# EAGLE schematic Full (EAGLE 9.6.2)
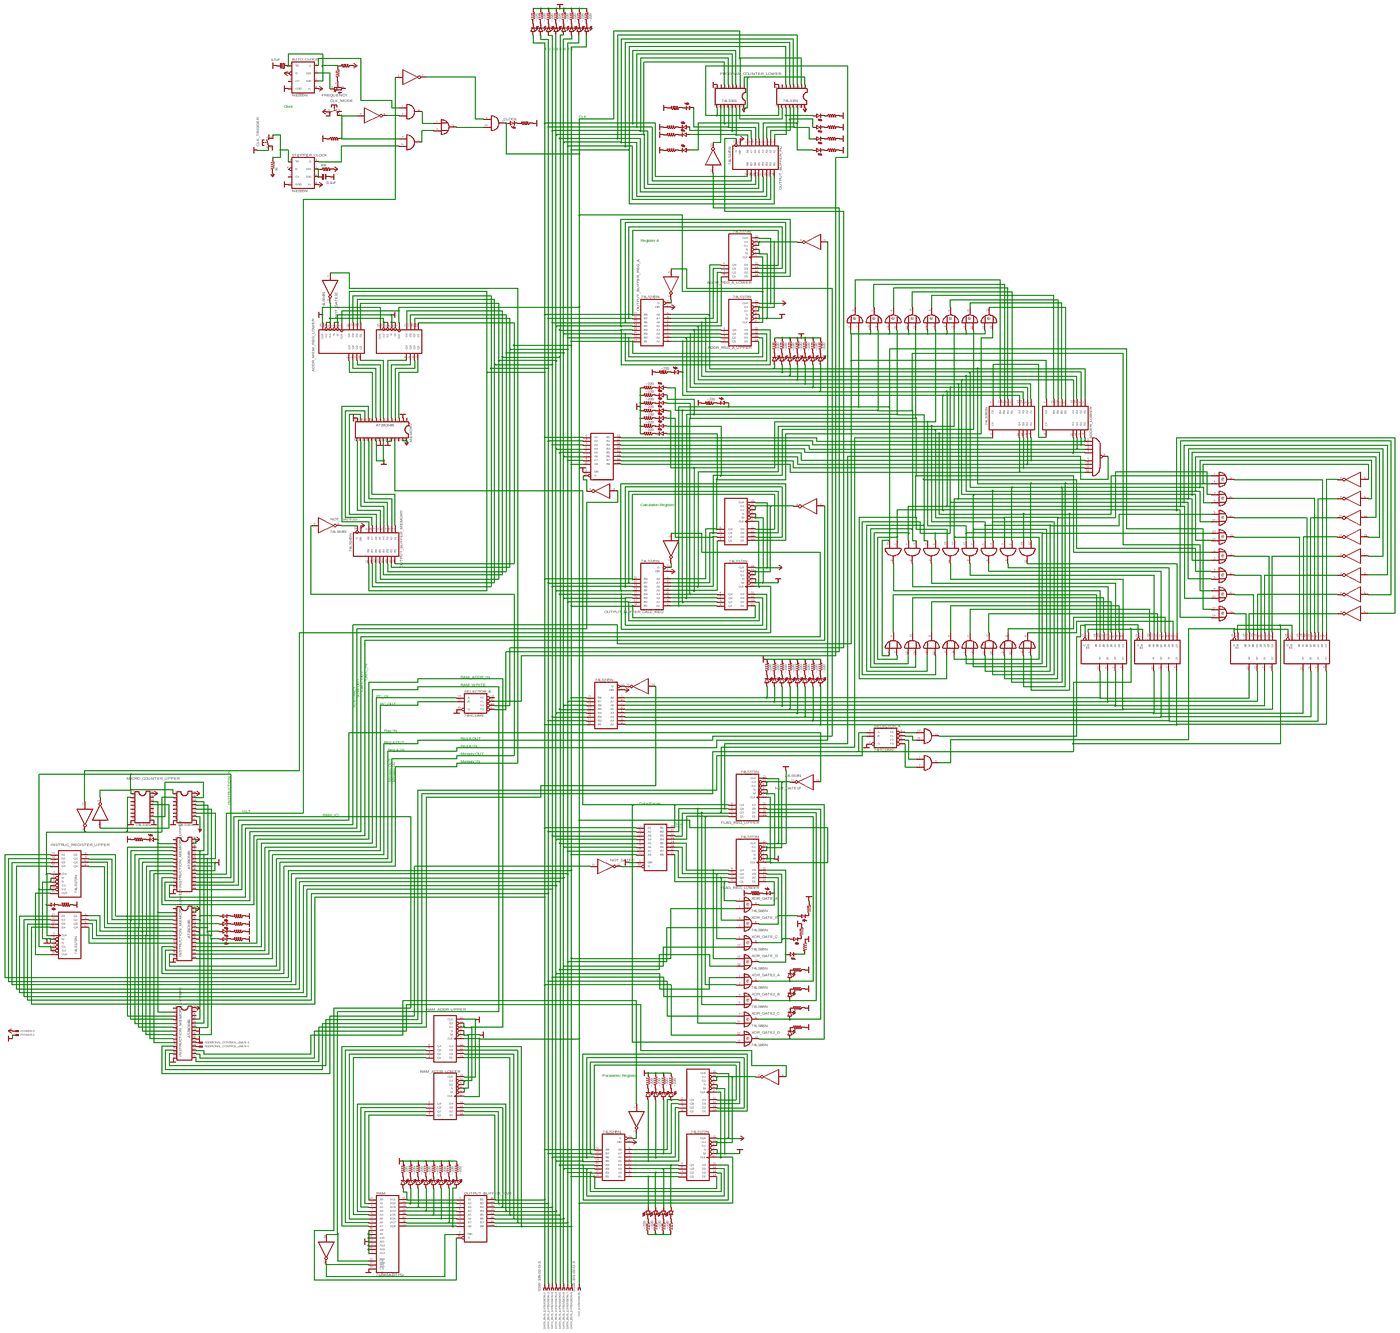
[diagram p0: schematic, sheet 1, overview]
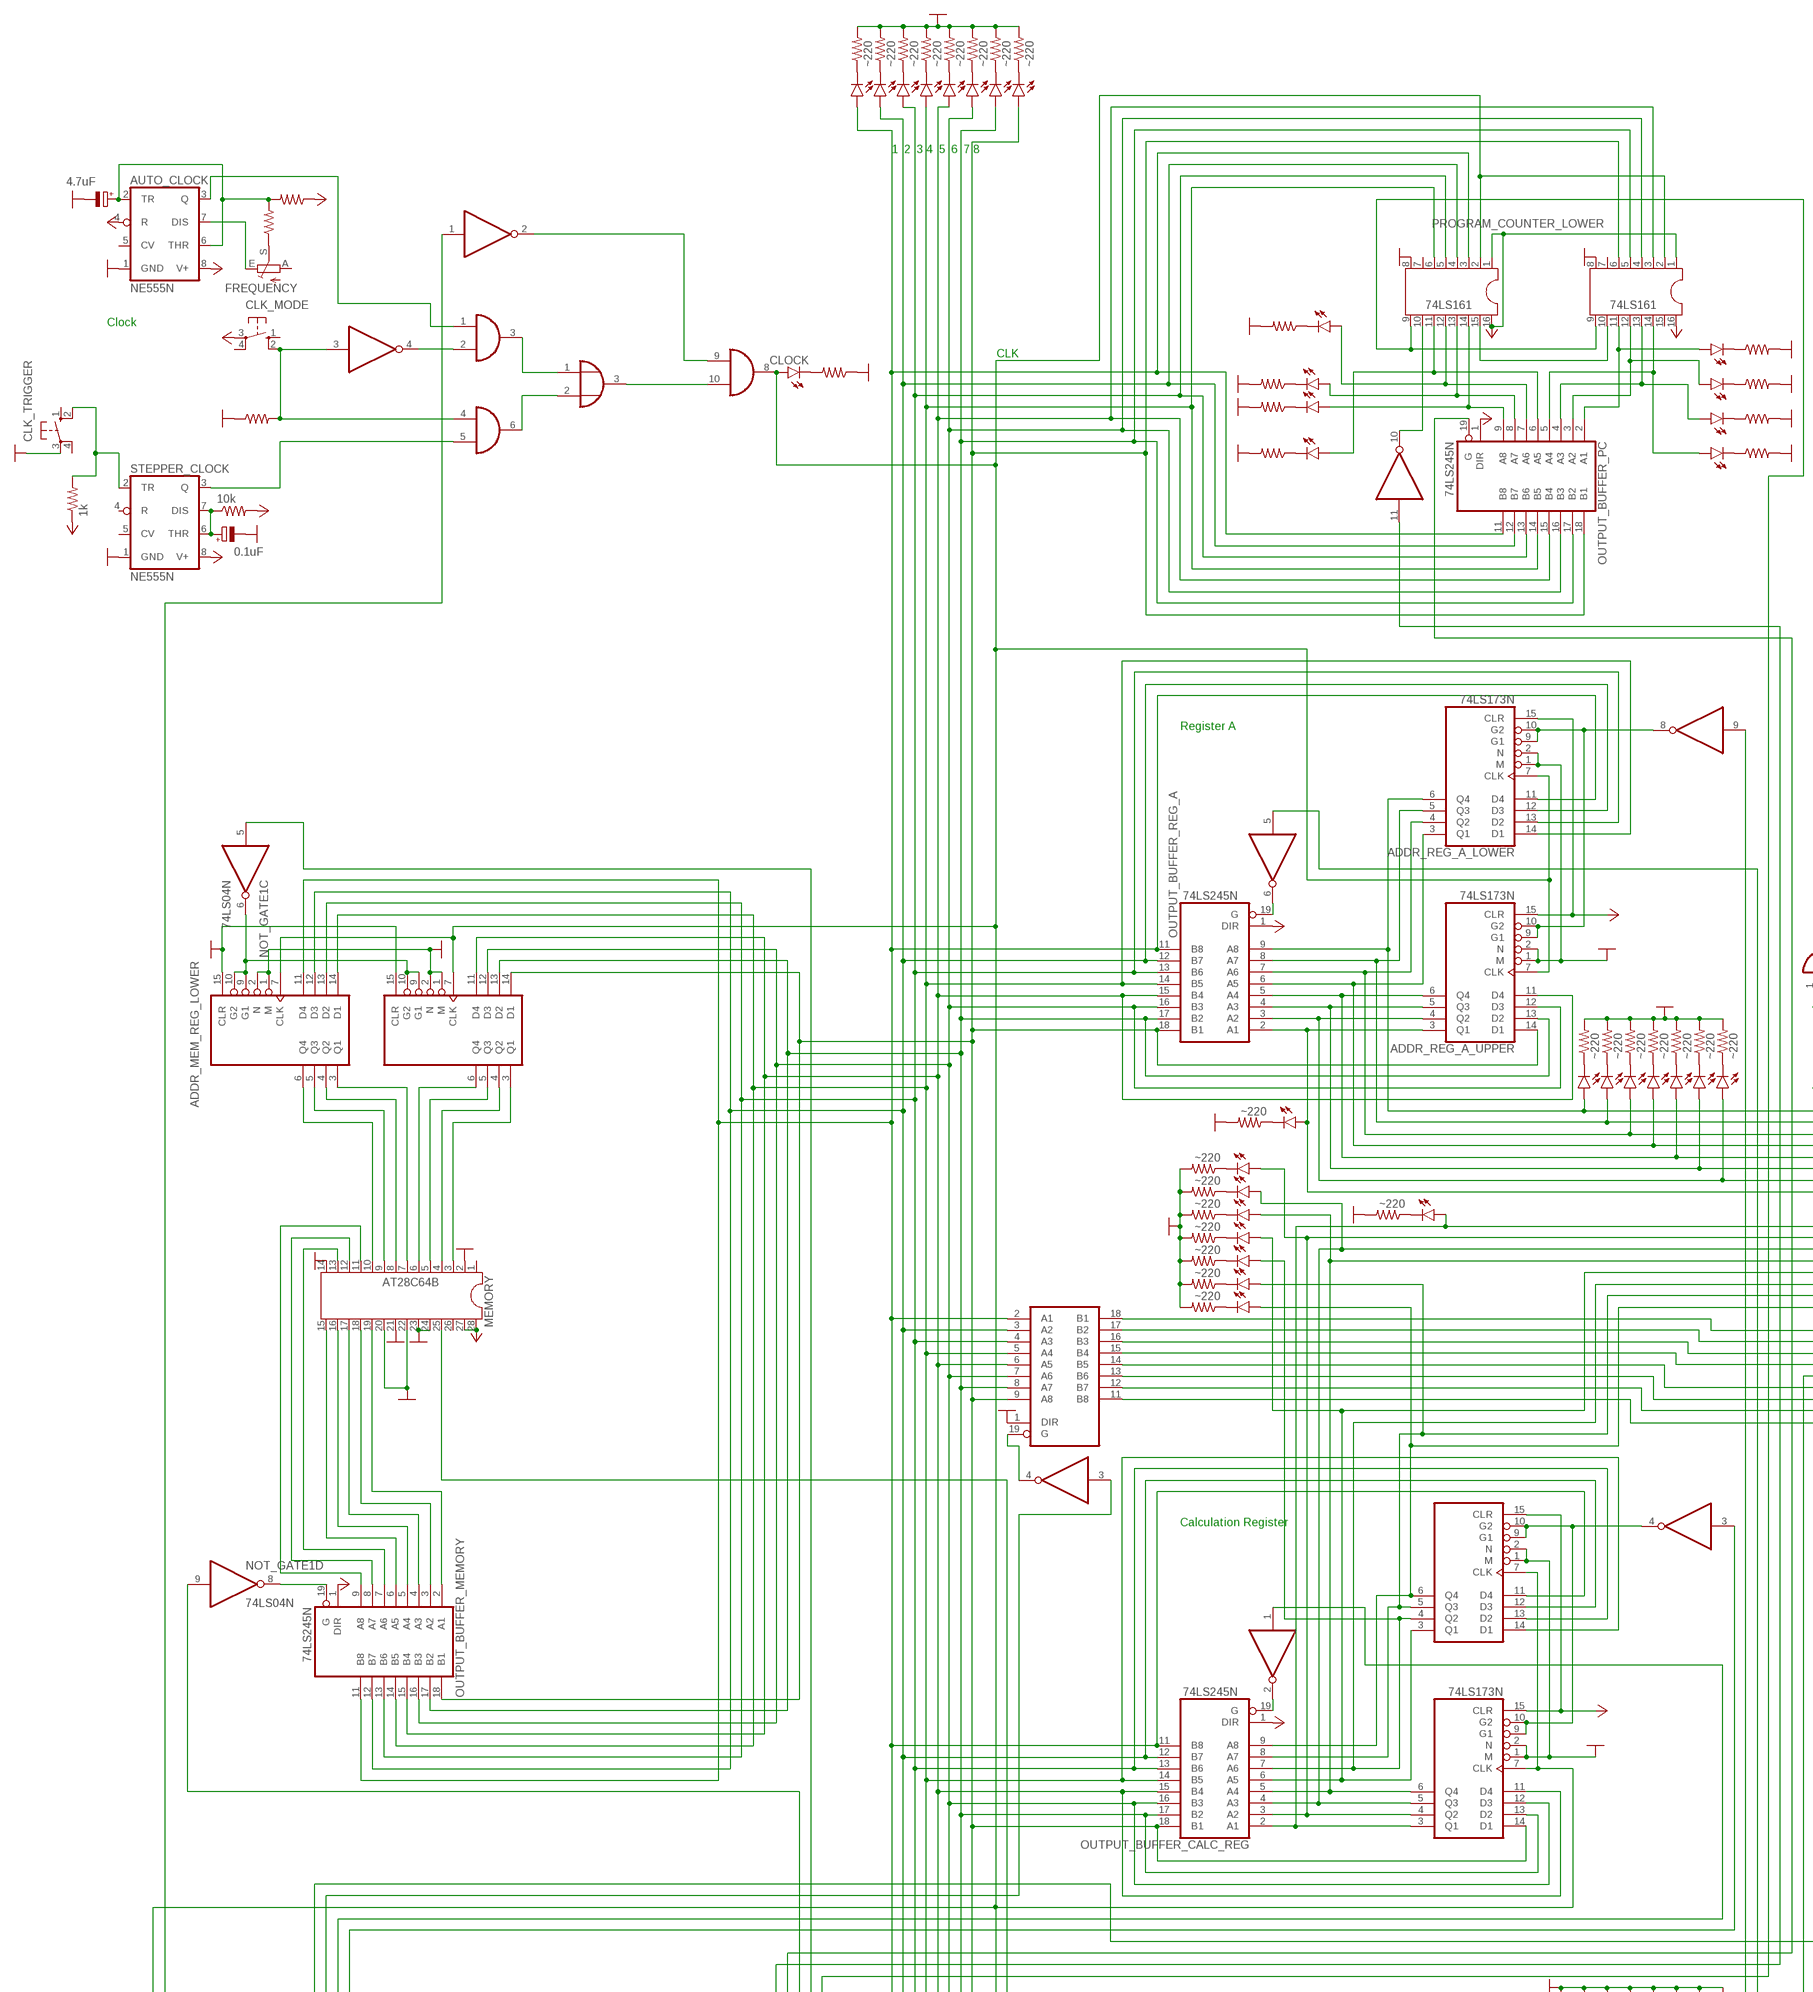
[diagram p1: schematic, sheet 1, part 1 of 4]
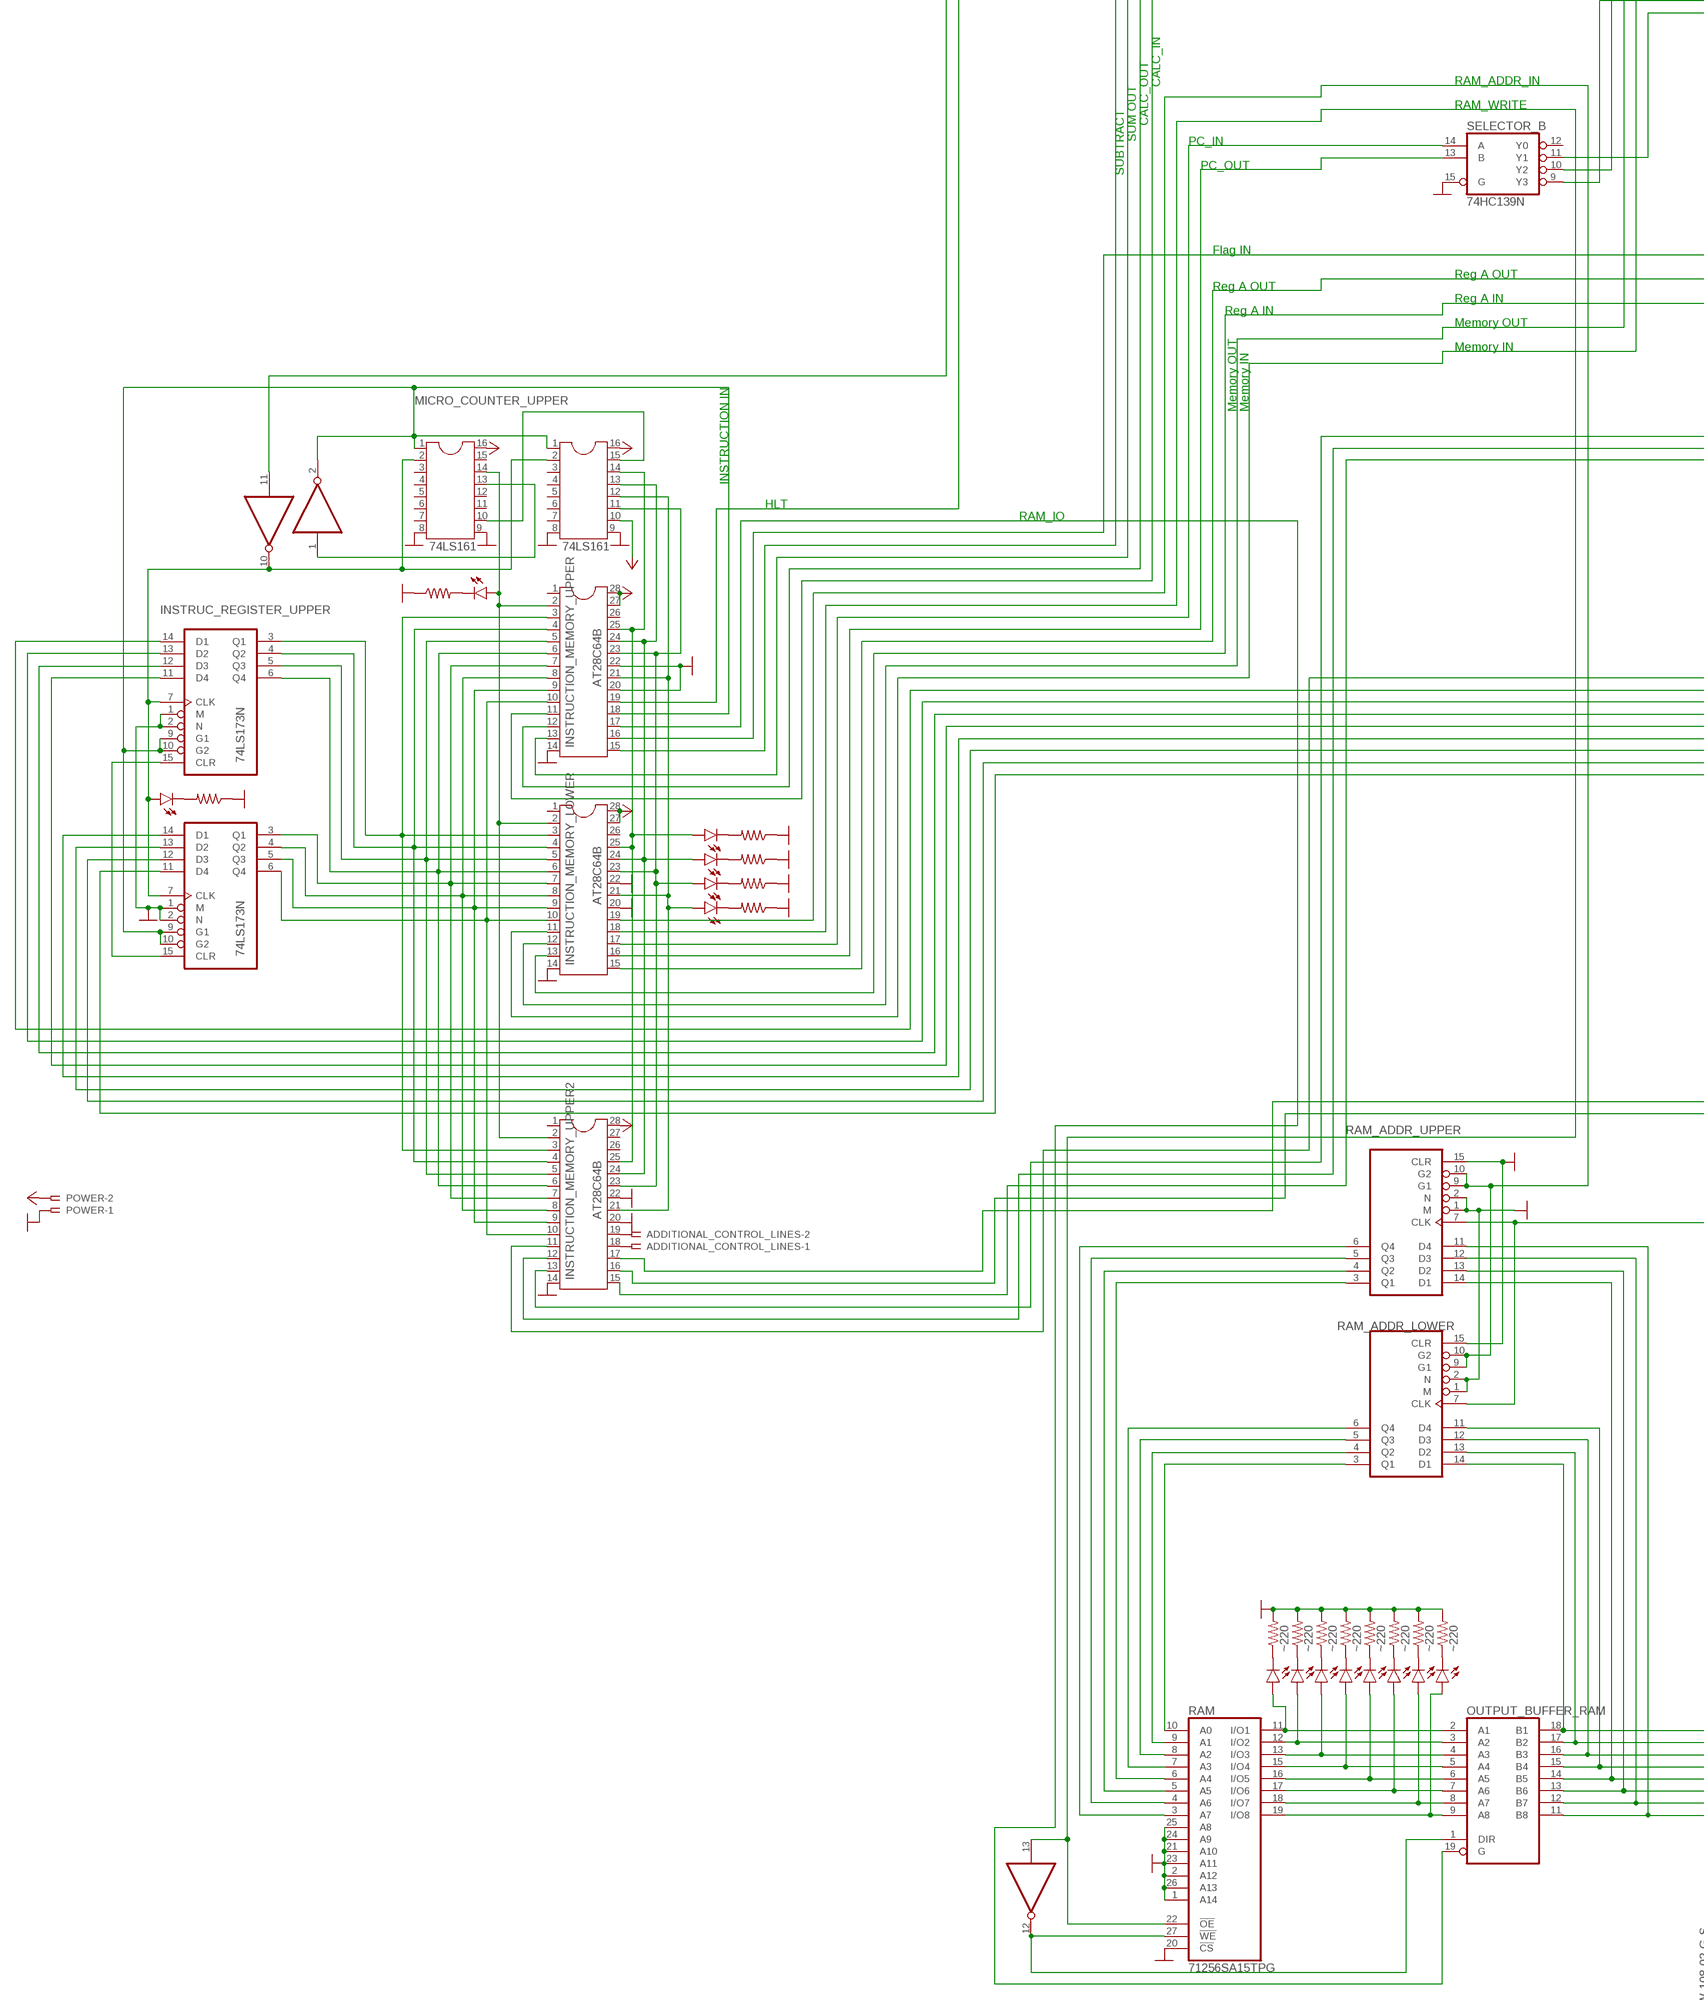
[diagram p2: schematic, sheet 1, part 2 of 4]
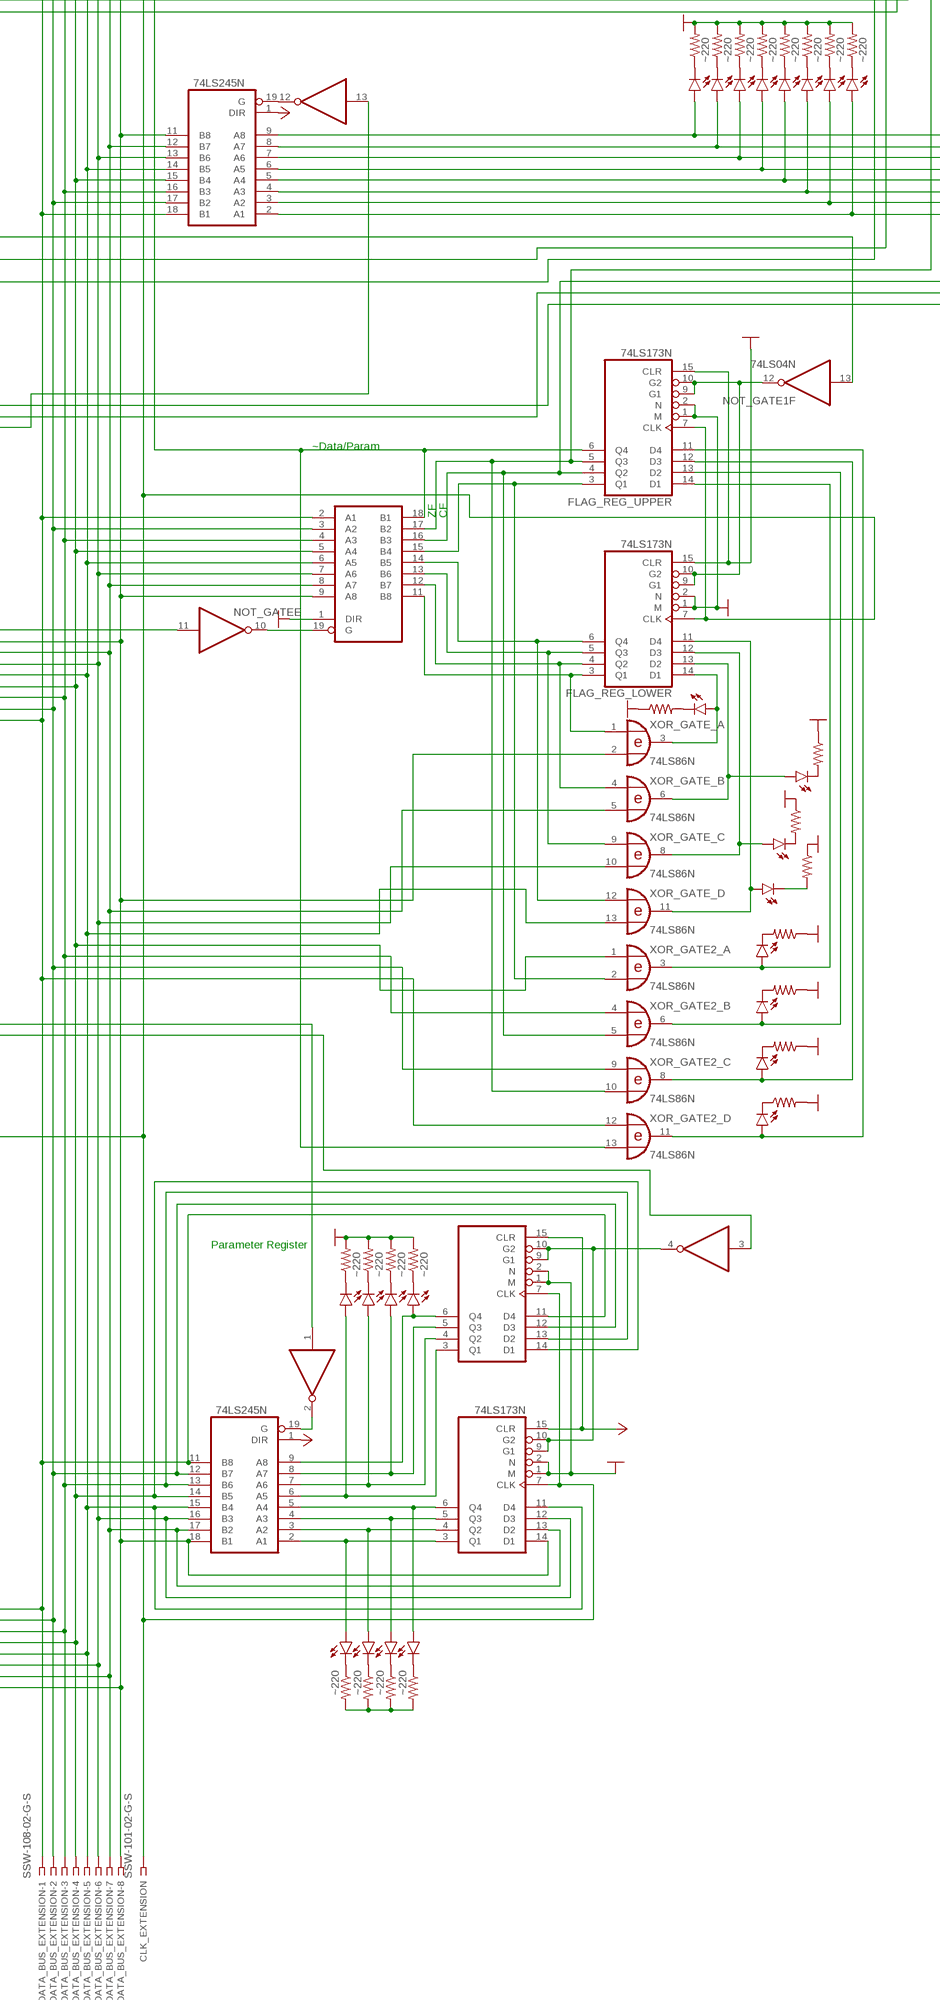
[diagram p3: schematic, sheet 1, part 3 of 4]
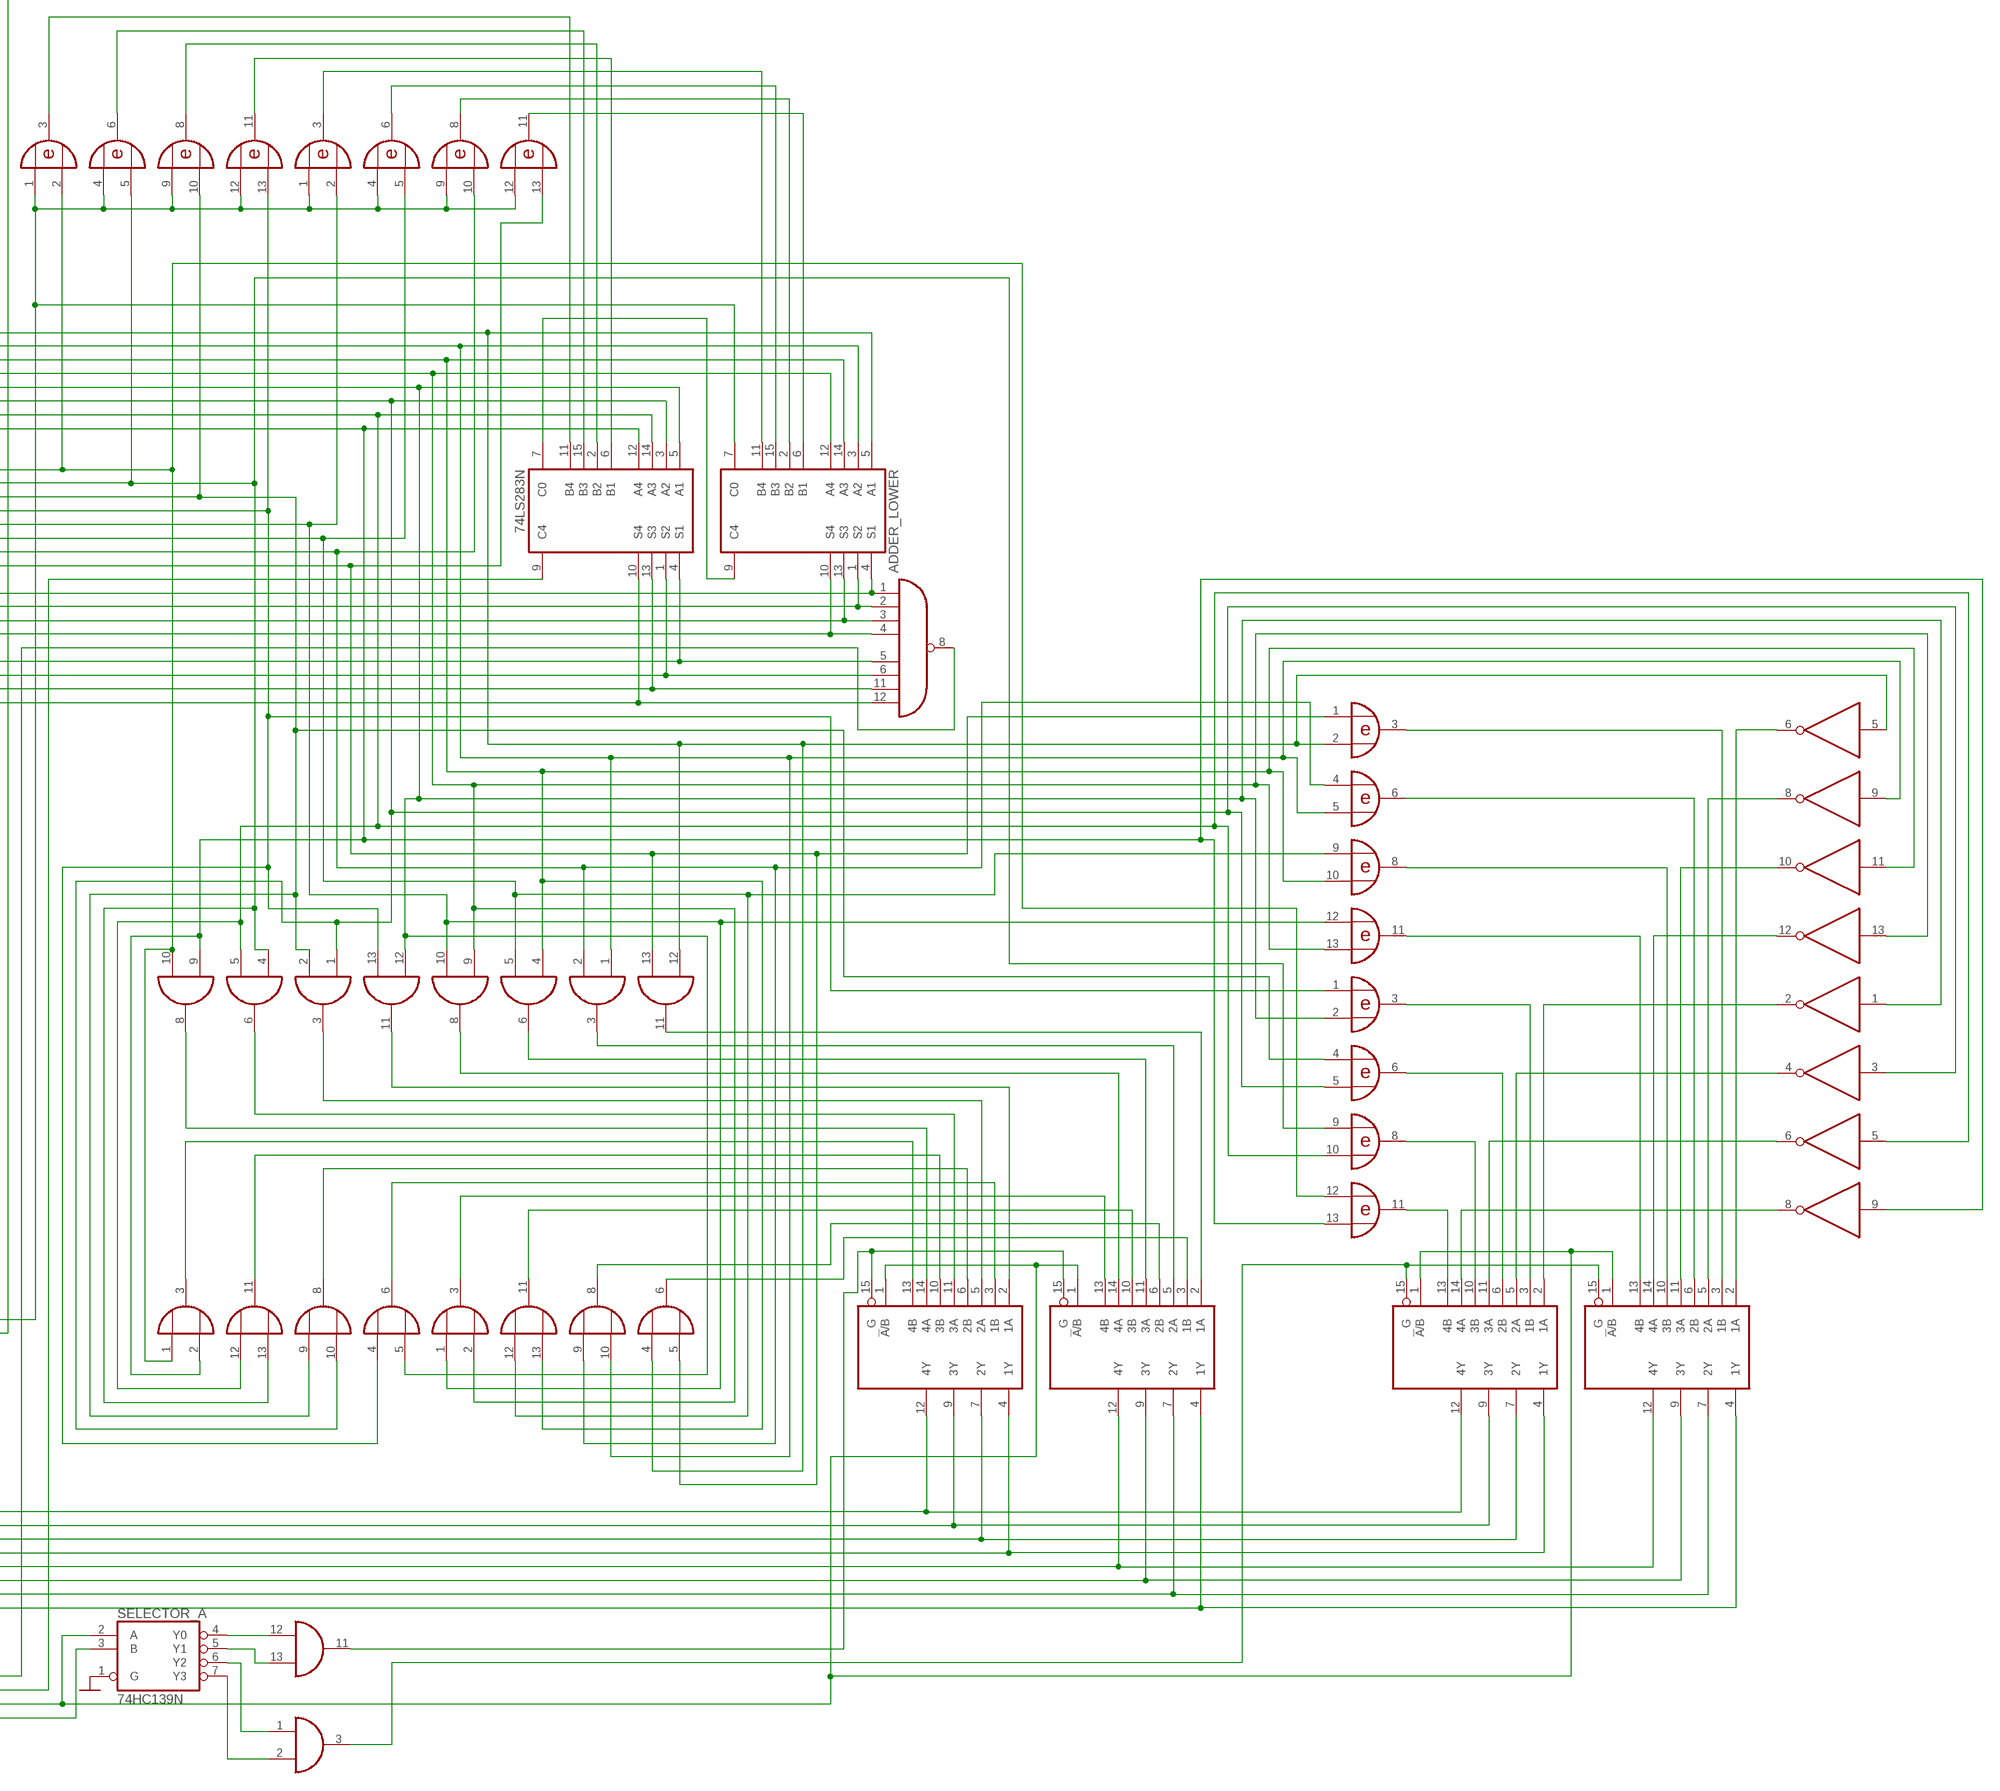
[diagram p4: schematic, sheet 1, part 4 of 4]

## Parts
ADDER_LOWER  74LS283N  [DIL16]
ADDER_UPPER  74LS283N  [DIL16]
ADDITIONAL_CONTROL_LINES  SSW-102-02-G-S  [SSW-102-02-G-S]
ADDR_MEM_REG_LOWER  74LS173N  [DIL16]
ADDR_MEM_REG_UPPER  74LS173N  [DIL16]
ADDR_REG_A_LOWER  74LS173N  [DIL16]
ADDR_REG_A_UPPER  74LS173N  [DIL16]
ADDR_REG_CALC_LOWER  74LS173N  [DIL16]
ADDR_REG_CALC_LOWER1  74LS173N  [DIL16]
ADDR_REG_CALC_UPPER  74LS173N  [DIL16]
ADDR_REG_PARAM_UPPER  74LS173N  [DIL16]
AND_GATE1  74LS30N  [DIL14]
AND_GATE1_  74LS08N  [DIL14]
AND_GATE2_  74LS08N  [DIL14]
AND_GATE3_  74LS08N  [DIL14]
AND_GATE_  74LS08N  [DIL14]
AUTO_CLOCK  NE555N  [DIL08]
C1  4.7uF  CPOL-EUE2-5  [E2-5]
C2  0.1uF  CPOL-EUE2-5  [E2-5]
CLK_EXTENSION  SSW-101-02-G-S  [SSW-101-02-G-S]
CLK_MODE  10-XX  [B3F-10XX]
CLK_TRIGGER  10-XX  [B3F-10XX]
CLOCK  LED5MM  [LED5MM]
DATA_BUS_EXTENSION  SSW-108-02-G-S  [SSW-108-02-G-S]
DATABUS_1  LED5MM  [LED5MM]
DATABUS_2  LED5MM  [LED5MM]
DATABUS_3  LED5MM  [LED5MM]
DATABUS_4  LED5MM  [LED5MM]
DATABUS_5  LED5MM  [LED5MM]
DATABUS_6  LED5MM  [LED5MM]
DATABUS_7  LED5MM  [LED5MM]
DATABUS_8  LED5MM  [LED5MM]
FLAG_1  LED5MM  [LED5MM]
FLAG_2  LED5MM  [LED5MM]
FLAG_3  LED5MM  [LED5MM]
FLAG_4  LED5MM  [LED5MM]
FLAG_5  LED5MM  [LED5MM]
FLAG_6  LED5MM  [LED5MM]
FLAG_7  LED5MM  [LED5MM]
FLAG_8  LED5MM  [LED5MM]
FLAG_REG_LOWER  74LS173N  [DIL16]
FLAG_REG_UPPER  74LS173N  [DIL16]
FREQUENCY  100k  TRIM_EU-RJ9W  [RJ9W]
INSTRUC_REGISTER_LOWER  74LS173N  [DIL16]
INSTRUC_REGISTER_UPPER  74LS173N  [DIL16]
INSTRUCTION_MEMORY_LOWER  AT28C64B  DIL28  [DIL28-6]
INSTRUCTION_MEMORY_UPPER  AT28C64B  DIL28  [DIL28-6]
INSTRUCTION_MEMORY_UPPER2  AT28C64B  DIL28  [DIL28-6]
INVERTED_CLK_LED  LED5MM  [LED5MM]
LED_A_REG_1  LED5MM  [LED5MM]
LED_A_REG_2  LED5MM  [LED5MM]
LED_A_REG_3  LED5MM  [LED5MM]
LED_A_REG_4  LED5MM  [LED5MM]
LED_A_REG_5  LED5MM  [LED5MM]
LED_A_REG_6  LED5MM  [LED5MM]
LED_A_REG_7  LED5MM  [LED5MM]
LED_A_REG_8  LED5MM  [LED5MM]
LED_B_REG_1  LED5MM  [LED5MM]
LED_B_REG_2  LED5MM  [LED5MM]
LED_B_REG_3  LED5MM  [LED5MM]
LED_B_REG_4  LED5MM  [LED5MM]
LED_B_REG_5  LED5MM  [LED5MM]
LED_B_REG_6  LED5MM  [LED5MM]
LED_B_REG_7  LED5MM  [LED5MM]
LED_B_REG_8  LED5MM  [LED5MM]
LOGIC_LED_1  LED3MM  [LED3MM]
LOGIC_LED_2  LED3MM  [LED3MM]
LOGIC_LED_3  LED3MM  [LED3MM]
LOGIC_LED_4  LED3MM  [LED3MM]
LOGIC_LED_5  LED3MM  [LED3MM]
LOGIC_LED_6  LED3MM  [LED3MM]
LOGIC_LED_7  LED3MM  [LED3MM]
LOGIC_LED_8  LED3MM  [LED3MM]
LOGIC_SELECTOR-AND/OR_LOWER  74LS157N  [DIL16]
LOGIC_SELECTOR-AND/OR_UPPER  74LS157N  [DIL16]
LOGIC_SELECTOR-XOR/NOT_LOWER  74LS157N  [DIL16]
LOGIC_SELECTOR-XOR/NOT_UPPER  74LS157N  [DIL16]
MEMORY  AT28C64B  DIL28  [DIL28-6]
MICRO_COUNTER_LOWER  74LS161  DIL16  [DIL16]
MICRO_COUNTER_UPPER  74LS161  DIL16  [DIL16]
NOT_GATE  74LS04N  [DIL14]
NOT_GATE1  74LS04N  [DIL14]
NOT_GATE2_  74LS04N  [DIL14]
NOT_GATE2_1  74LS04N  [DIL14]
NOT_GATE3_  74LS04N  [DIL14]
OR_GATE  74LS32N  [DIL14]
OR_GATE1  74LS32N  [DIL14]
OR_GATE_2  74LS32N  [DIL14]
OUTPUT_BUFFER_ALU  74LS245N  [DIL20]
OUTPUT_BUFFER_CALC_REG  74LS245N  [DIL20]
OUTPUT_BUFFER_FLAGS  74HC245N  [DIL20]
OUTPUT_BUFFER_LOGIC  74LS245N  [DIL20]
OUTPUT_BUFFER_MEMORY  74LS245N  [DIL20]
OUTPUT_BUFFER_PARAM_REG  74LS245N  [DIL20]
OUTPUT_BUFFER_PC  74LS245N  [DIL20]
OUTPUT_BUFFER_RAM  74HC245N  [DIL20]
OUTPUT_BUFFER_REG_A  74LS245N  [DIL20]
PARAM_LED_1  LED3MM  [LED3MM]
PARAM_LED_2  LED3MM  [LED3MM]
PARAM_LED_3  LED3MM  [LED3MM]
PARAM_LED_4  LED3MM  [LED3MM]
PARAM_LED_5  LED3MM  [LED3MM]
PARAM_LED_6  LED3MM  [LED3MM]
PARAM_LED_7  LED3MM  [LED3MM]
PARAM_LED_8  LED3MM  [LED3MM]
PC_1  LED5MM  [LED5MM]
PC_2  LED5MM  [LED5MM]
PC_3  LED5MM  [LED5MM]
PC_4  LED5MM  [LED5MM]
PC_5  LED5MM  [LED5MM]
PC_6  LED5MM  [LED5MM]
PC_7  LED5MM  [LED5MM]
PC_8  LED5MM  [LED5MM]
POWER  SSW-102-02-G-S  [SSW-102-02-G-S]
PROGRAM_COUNTER_LOWER  74LS161  DIL16  [DIL16]
PROGRAM_COUNTER_UPPER  74LS161  DIL16  [DIL16]
R1  1k  R-US_0204/7  [0204/7]
R2  1k  R-US_0204/7  [0204/7]
R3  10k  R-US_0204/7  [0204/7]
R4  220  R-US_0204/7  [0204/7]
R5  ~220  R-US_0204/7  [0204/7]
R6  ~220  R-US_0204/7  [0204/7]
R7  220  R-US_0204/7  [0204/7]
R8  ~220  R-US_0204/7  [0204/7]
R9  ~220  R-US_0204/7  [0204/7]
R10  ~220  R-US_0204/7  [0204/7]
R11  ~220  R-US_0204/7  [0204/7]
R12  ~220  R-US_0204/7  [0204/7]
R13  ~220  R-US_0204/7  [0204/7]
R14  ~220  R-US_0204/7  [0204/7]
R15  ~220  R-US_0204/7  [0204/7]
R16  ~220  R-US_0204/7  [0204/7]
R17  ~220  R-US_0204/7  [0204/7]
R18  ~220  R-US_0204/7  [0204/7]
R19  ~220  R-US_0204/7  [0204/7]
R20  ~220  R-US_0204/7  [0204/7]
R21  ~220  R-US_0204/7  [0204/7]
R22  ~220  R-US_0204/7  [0204/7]
R23  ~220  R-US_0204/7  [0204/7]
R24  ~220  R-US_0204/7  [0204/7]
R25  ~220  R-US_0204/7  [0204/7]
R26  ~220  R-US_0204/7  [0204/7]
R27  ~220  R-US_0204/7  [0204/7]
R28  ~220  R-US_0204/7  [0204/7]
R29  ~220  R-US_0204/7  [0204/7]
R30  ~220  R-US_0204/7  [0204/7]
R31  ~220  R-US_0204/7  [0204/7]
R32  ~220  R-US_0204/7  [0204/7]
R33  ~220  R-US_0204/7  [0204/7]
R34  ~220  R-US_0204/7  [0204/7]
R35  ~220  R-US_0204/7  [0204/7]
R36  ~220  R-US_0204/7  [0204/7]
R37  ~220  R-US_0204/7  [0204/7]
R38  ~220  R-US_0204/7  [0204/7]
R39  ~220  R-US_0204/7  [0204/7]
R40  ~220  R-US_0204/7  [0204/7]
R41  ~220  R-US_0204/7  [0204/7]
R42  ~220  R-US_0204/7  [0204/7]
R43  ~220  R-US_0204/7  [0204/7]
R44  ~220  R-US_0204/7  [0204/7]
R45  ~220  R-US_0204/7  [0204/7]
R46  ~220  R-US_0204/7  [0204/7]
R47  ~220  R-US_0204/7  [0204/7]
R48  ~220  R-US_0204/7  [0204/7]
R49  ~220  R-US_0204/7  [0204/7]
R50  ~220  R-US_0204/7  [0204/7]
R51  ~220  R-US_0204/7  [0204/7]
R52  ~220  R-US_0204/7  [0204/7]
R53  ~220  R-US_0204/7  [0204/7]
R54  ~220  R-US_0204/7  [0204/7]
R55  ~220  R-US_0204/7  [0204/7]
R56  ~220  R-US_0204/7  [0204/7]
R57  ~220  R-US_0204/7  [0204/7]
R58  ~220  R-US_0204/7  [0204/7]
R59  ~220  R-US_0204/7  [0204/7]
R60  ~220  R-US_0204/7  [0204/7]
R61  ~220  R-US_0204/7  [0204/7]
R62  ~220  R-US_0204/7  [0204/7]
R63  ~220  R-US_0204/7  [0204/7]
R64  ~220  R-US_0204/7  [0204/7]
R65  ~220  R-US_0204/7  [0204/7]
R66  ~220  R-US_0204/7  [0204/7]
R67  ~220  R-US_0204/7  [0204/7]
R68  ~220  R-US_0204/7  [0204/7]
R69  ~220  R-US_0204/7  [0204/7]
R70  ~220  R-US_0204/7  [0204/7]
R71  ~220  R-US_0204/7  [0204/7]
R72  ~220  R-US_0204/7  [0204/7]
R73  ~220  R-US_0204/7  [0204/7]
R74  ~220  R-US_0204/7  [0204/7]
R75  ~220  R-US_0204/7  [0204/7]
R76  ~220  R-US_0204/7  [0204/7]
RAM  71256SA15TPG  71256P  [DIL28-6]
RAM_ADDR_LOWER  74LS173N  [DIL16]
RAM_ADDR_UPPER  74LS173N  [DIL16]
RAM_LED_1  LED3MM  [LED3MM]
RAM_LED_2  LED3MM  [LED3MM]
RAM_LED_3  LED3MM  [LED3MM]
RAM_LED_4  LED3MM  [LED3MM]
RAM_LED_5  LED3MM  [LED3MM]
RAM_LED_6  LED3MM  [LED3MM]
RAM_LED_7  LED3MM  [LED3MM]
RAM_LED_8  LED3MM  [LED3MM]
SELECTOR_  74HC139N  [DIL16]
STEPPER_CLOCK  NE555N  [DIL08]
SUBTRACT_INVRTR_LOWER_  74LS86N  [DIL14]
SUBTRACT_INVRTR_LOWER_1  74LS86N  [DIL14]
SUBTRACT_INVRTR_UPPER_  74LS86N  [DIL14]
SUBTRACT_INVRTR_UPPER_1  74LS86N  [DIL14]
USTEP_1  LED5MM  [LED5MM]
USTEP_2  LED5MM  [LED5MM]
USTEP_3  LED5MM  [LED5MM]
USTEP_4  LED5MM  [LED5MM]
USTEP_5  LED5MM  [LED5MM]
XOR_GATE2_  74LS86N  [DIL14]
XOR_GATE_  74LS86N  [DIL14]

## Nets
1_PLACE: ADDR_MEM_REG_LOWER.11(D4) ADDR_REG_A_LOWER.11(D4) ADDR_REG_CALC_LOWER1.11(D4) ADDR_REG_CALC_LOWER.11(D4) DATA_BUS_EXTENSION.1 DATABUS_1.A INSTRUC_REGISTER_LOWER.11(D4) OUTPUT_BUFFER_ALU.2(A1) OUTPUT_BUFFER_CALC_REG.11(B8) OUTPUT_BUFFER_FLAGS.2(A1) OUTPUT_BUFFER_LOGIC.18(B1) OUTPUT_BUFFER_MEMORY.11(B8) OUTPUT_BUFFER_PARAM_REG.11(B8) OUTPUT_BUFFER_PC.11(B8) OUTPUT_BUFFER_RAM.18(B1) OUTPUT_BUFFER_REG_A.11(B8) PROGRAM_COUNTER_LOWER.3 RAM_ADDR_LOWER.14(D1) XOR_GATE2_.12(D:I0)
2_PLACE: ADDR_MEM_REG_LOWER.12(D3) ADDR_REG_A_LOWER.12(D3) ADDR_REG_CALC_LOWER1.12(D3) ADDR_REG_CALC_LOWER.12(D3) DATA_BUS_EXTENSION.2 DATABUS_2.A INSTRUC_REGISTER_LOWER.12(D3) OUTPUT_BUFFER_ALU.3(A2) OUTPUT_BUFFER_CALC_REG.12(B7) OUTPUT_BUFFER_FLAGS.3(A2) OUTPUT_BUFFER_LOGIC.17(B2) OUTPUT_BUFFER_MEMORY.12(B7) OUTPUT_BUFFER_PARAM_REG.12(B7) OUTPUT_BUFFER_PC.12(B7) OUTPUT_BUFFER_RAM.17(B2) OUTPUT_BUFFER_REG_A.12(B7) PROGRAM_COUNTER_LOWER.4 RAM_ADDR_LOWER.13(D2) XOR_GATE2_.9(C:I0)
4_PLACE: ADDR_MEM_REG_LOWER.13(D2) ADDR_REG_A_LOWER.13(D2) ADDR_REG_CALC_LOWER1.13(D2) ADDR_REG_CALC_LOWER.13(D2) DATA_BUS_EXTENSION.3 DATABUS_3.A INSTRUC_REGISTER_LOWER.13(D2) OUTPUT_BUFFER_ALU.4(A3) OUTPUT_BUFFER_CALC_REG.13(B6) OUTPUT_BUFFER_FLAGS.4(A3) OUTPUT_BUFFER_LOGIC.16(B3) OUTPUT_BUFFER_MEMORY.13(B6) OUTPUT_BUFFER_PARAM_REG.13(B6) OUTPUT_BUFFER_PC.13(B6) OUTPUT_BUFFER_RAM.16(B3) OUTPUT_BUFFER_REG_A.13(B6) PROGRAM_COUNTER_LOWER.5 RAM_ADDR_LOWER.12(D3) XOR_GATE2_.4(B:I0)
8_PLACE: ADDR_MEM_REG_LOWER.14(D1) ADDR_REG_A_LOWER.14(D1) ADDR_REG_CALC_LOWER1.14(D1) ADDR_REG_CALC_LOWER.14(D1) DATA_BUS_EXTENSION.4 DATABUS_4.A INSTRUC_REGISTER_LOWER.14(D1) OUTPUT_BUFFER_ALU.5(A4) OUTPUT_BUFFER_CALC_REG.14(B5) OUTPUT_BUFFER_FLAGS.5(A4) OUTPUT_BUFFER_LOGIC.15(B4) OUTPUT_BUFFER_MEMORY.14(B5) OUTPUT_BUFFER_PARAM_REG.14(B5) OUTPUT_BUFFER_PC.14(B5) OUTPUT_BUFFER_RAM.15(B4) OUTPUT_BUFFER_REG_A.14(B5) PROGRAM_COUNTER_LOWER.6 RAM_ADDR_LOWER.11(D4) XOR_GATE2_.1(A:I0)
16_PLACE: ADDR_MEM_REG_UPPER.11(D4) ADDR_REG_A_UPPER.11(D4) ADDR_REG_CALC_UPPER.11(D4) ADDR_REG_PARAM_UPPER.11(D4) DATA_BUS_EXTENSION.5 DATABUS_5.A INSTRUC_REGISTER_UPPER.11(D4) OUTPUT_BUFFER_ALU.6(A5) OUTPUT_BUFFER_CALC_REG.15(B4) OUTPUT_BUFFER_FLAGS.6(A5) OUTPUT_BUFFER_LOGIC.14(B5) OUTPUT_BUFFER_MEMORY.15(B4) OUTPUT_BUFFER_PARAM_REG.15(B4) OUTPUT_BUFFER_PC.15(B4) OUTPUT_BUFFER_RAM.14(B5) OUTPUT_BUFFER_REG_A.15(B4) PROGRAM_COUNTER_UPPER.3 RAM_ADDR_UPPER.14(D1) XOR_GATE_.13(D:I1)
32_PLACE: ADDR_MEM_REG_UPPER.12(D3) ADDR_REG_A_UPPER.12(D3) ADDR_REG_CALC_UPPER.12(D3) ADDR_REG_PARAM_UPPER.12(D3) DATA_BUS_EXTENSION.6 DATABUS_6.A INSTRUC_REGISTER_UPPER.12(D3) OUTPUT_BUFFER_ALU.7(A6) OUTPUT_BUFFER_CALC_REG.16(B3) OUTPUT_BUFFER_FLAGS.7(A6) OUTPUT_BUFFER_LOGIC.13(B6) OUTPUT_BUFFER_MEMORY.16(B3) OUTPUT_BUFFER_PARAM_REG.16(B3) OUTPUT_BUFFER_PC.16(B3) OUTPUT_BUFFER_RAM.13(B6) OUTPUT_BUFFER_REG_A.16(B3) PROGRAM_COUNTER_UPPER.4 RAM_ADDR_UPPER.13(D2) XOR_GATE_.10(C:I1)
64_PLACE: ADDR_MEM_REG_UPPER.13(D2) ADDR_REG_A_UPPER.13(D2) ADDR_REG_CALC_UPPER.13(D2) ADDR_REG_PARAM_UPPER.13(D2) DATA_BUS_EXTENSION.7 DATABUS_7.A INSTRUC_REGISTER_UPPER.13(D2) OUTPUT_BUFFER_ALU.8(A7) OUTPUT_BUFFER_CALC_REG.17(B2) OUTPUT_BUFFER_FLAGS.8(A7) OUTPUT_BUFFER_LOGIC.12(B7) OUTPUT_BUFFER_MEMORY.17(B2) OUTPUT_BUFFER_PARAM_REG.17(B2) OUTPUT_BUFFER_PC.17(B2) OUTPUT_BUFFER_RAM.12(B7) OUTPUT_BUFFER_REG_A.17(B2) PROGRAM_COUNTER_UPPER.5 RAM_ADDR_UPPER.12(D3) XOR_GATE_.5(B:I1)
128_PLACE: ADDR_MEM_REG_UPPER.14(D1) ADDR_REG_A_UPPER.14(D1) ADDR_REG_CALC_UPPER.14(D1) ADDR_REG_PARAM_UPPER.14(D1) DATA_BUS_EXTENSION.8 DATABUS_8.A INSTRUC_REGISTER_UPPER.14(D1) OUTPUT_BUFFER_ALU.9(A8) OUTPUT_BUFFER_CALC_REG.18(B1) OUTPUT_BUFFER_FLAGS.9(A8) OUTPUT_BUFFER_LOGIC.11(B8) OUTPUT_BUFFER_MEMORY.18(B1) OUTPUT_BUFFER_PARAM_REG.18(B1) OUTPUT_BUFFER_PC.18(B1) OUTPUT_BUFFER_RAM.11(B8) OUTPUT_BUFFER_REG_A.18(B1) PROGRAM_COUNTER_UPPER.6 RAM_ADDR_UPPER.11(D4) XOR_GATE_.2(A:I1)
+5V: AUTO_CLOCK.4(R) AUTO_CLOCK.8(V+) CLK_MODE.3(P) R1.1 R2.1 R3.2 STEPPER_CLOCK.8(V+)
CLOCK: ADDR_MEM_REG_LOWER.7(CLK) ADDR_MEM_REG_UPPER.7(CLK) ADDR_REG_A_LOWER.7(CLK) ADDR_REG_A_UPPER.7(CLK) ADDR_REG_CALC_LOWER1.7(CLK) ADDR_REG_CALC_LOWER.7(CLK) ADDR_REG_CALC_UPPER.7(CLK) ADDR_REG_PARAM_UPPER.7(CLK) AND_GATE_.8(C:O) CLK_EXTENSION.1 CLOCK.A FLAG_REG_LOWER.7(CLK) FLAG_REG_UPPER.7(CLK) NOT_GATE1.11(E:I) PROGRAM_COUNTER_LOWER.2 PROGRAM_COUNTER_UPPER.2 RAM_ADDR_LOWER.7(CLK) RAM_ADDR_UPPER.7(CLK)
CTRL_SIG_5: INSTRUCTION_MEMORY_LOWER.16 SELECTOR_.13(B:B)
CTRL_SIG_6: INSTRUCTION_MEMORY_LOWER.17 SELECTOR_.14(B:A)
CTRL_SIG_9_(CALC_REG_IN): INSTRUCTION_MEMORY_UPPER.11 NOT_GATE2_.3(B:I)
CTRL_SIG_10_(CALC_REG_OUT): INSTRUCTION_MEMORY_UPPER.12 NOT_GATE2_.1(A:I)
CTRL_SIG_11_(SUM_OUT): INSTRUCTION_MEMORY_UPPER.13 NOT_GATE3_.3(B:I)
CTRL_SIG_12_(SUBTRACT): ADDER_LOWER.7(C0) INSTRUCTION_MEMORY_UPPER.15 SUBTRACT_INVRTR_LOWER_.1(A:I0) SUBTRACT_INVRTR_LOWER_.4(B:I0) SUBTRACT_INVRTR_LOWER_.9(C:I0) SUBTRACT_INVRTR_LOWER_.12(D:I0) SUBTRACT_INVRTR_UPPER_.1(A:I0) SUBTRACT_INVRTR_UPPER_.4(B:I0) SUBTRACT_INVRTR_UPPER_.9(C:I0) SUBTRACT_INVRTR_UPPER_.12(D:I0)
FLAG_OUT: INSTRUCTION_MEMORY_UPPER2.11 NOT_GATE.11(E:I)
FLAG_TOGGLE_IN: INSTRUCTION_MEMORY_UPPER.16 NOT_GATE1.13(F:I)
GND: ADDR_MEM_REG_LOWER.1(M) ADDR_MEM_REG_LOWER.2(N) ADDR_MEM_REG_LOWER.15(CLR) ADDR_MEM_REG_UPPER.1(M) ADDR_MEM_REG_UPPER.2(N) ADDR_MEM_REG_UPPER.15(CLR) ADDR_REG_A_LOWER.1(M) ADDR_REG_A_LOWER.2(N) ADDR_REG_A_UPPER.1(M) ADDR_REG_A_UPPER.2(N) ADDR_REG_CALC_LOWER1.1(M) ADDR_REG_CALC_LOWER1.2(N) ADDR_REG_CALC_LOWER.1(M) ADDR_REG_CALC_LOWER.2(N) ADDR_REG_CALC_UPPER.1(M) ADDR_REG_CALC_UPPER.2(N) ADDR_REG_PARAM_UPPER.1(M) ADDR_REG_PARAM_UPPER.2(N) AUTO_CLOCK.1(GND) C1.- C2.- CLK_TRIGGER.3(P) FLAG_REG_LOWER.1(M) FLAG_REG_LOWER.2(N) FLAG_REG_LOWER.15(CLR) FLAG_REG_UPPER.1(M) FLAG_REG_UPPER.2(N) FLAG_REG_UPPER.15(CLR) INSTRUC_REGISTER_LOWER.1(M) INSTRUC_REGISTER_LOWER.2(N) INSTRUC_REGISTER_UPPER.1(M) INSTRUC_REGISTER_UPPER.2(N) INSTRUCTION_MEMORY_LOWER.14 INSTRUCTION_MEMORY_LOWER.20 INSTRUCTION_MEMORY_LOWER.22 INSTRUCTION_MEMORY_UPPER2.14 INSTRUCTION_MEMORY_UPPER2.20 INSTRUCTION_MEMORY_UPPER2.22 INSTRUCTION_MEMORY_UPPER.14 INSTRUCTION_MEMORY_UPPER.20 INSTRUCTION_MEMORY_UPPER.22 MEMORY.2 MEMORY.14 MEMORY.20 MEMORY.21 MEMORY.22 MEMORY.23 MEMORY.24 MICRO_COUNTER_LOWER.8 MICRO_COUNTER_LOWER.9 MICRO_COUNTER_UPPER.8 MICRO_COUNTER_UPPER.9 OUTPUT_BUFFER_ALU.1(DIR) OUTPUT_BUFFER_FLAGS.1(DIR) POWER.1 PROGRAM_COUNTER_LOWER.8 PROGRAM_COUNTER_UPPER.8 R4.1 R5.1 R6.2 R8.1 R9.1 R10.1 R11.1 R12.1 R13.1 R14.1 R15.2 R16.2 R17.2 R18.2 R19.2 R20.2 R21.2 R22.2 R23.2 R24.2 R25.2 R26.2 R27.2 R28.2 R29.2 R30.2 R31.2 R32.2 R33.2 R34.2 R35.2 R36.2 R37.2 R38.2 R39.2 R40.1 R41.1 R42.1 R43.1 R44.1 R45.1 R46.2 R47.2 R48.2 R49.2 R50.2 R51.2 R52.2 R53.2 R54.2 R55.2 R56.2 R57.2 R58.2 R59.2 R60.2 R61.2 R62.2 R63.2 R64.2 R65.2 R66.2 R67.2 R68.2 R69.2 R70.2 R71.2 R76.2 RAM.1(A14) RAM.2(A12) RAM.20(!CS) RAM.21(A10) RAM.23(A11) RAM.24(A9) RAM.25(A8) RAM.26(A13) RAM_ADDR_LOWER.1(M) RAM_ADDR_LOWER.2(N) RAM_ADDR_LOWER.15(CLR) RAM_ADDR_UPPER.1(M) RAM_ADDR_UPPER.2(N) RAM_ADDR_UPPER.15(CLR) SELECTOR_.1(A:G) SELECTOR_.15(B:G) STEPPER_CLOCK.1(GND)
HLT_SIGNAL: INSTRUCTION_MEMORY_UPPER.19 NOT_GATE1.1(A:I)
INSTRUCTION__A4: INSTRUC_REGISTER_UPPER.6(Q4) INSTRUCTION_MEMORY_LOWER.6 INSTRUCTION_MEMORY_UPPER2.6 INSTRUCTION_MEMORY_UPPER.6
INSTRUCTION_A1: INSTRUC_REGISTER_LOWER.6(Q4) INSTRUCTION_MEMORY_LOWER.10 INSTRUCTION_MEMORY_UPPER2.10 INSTRUCTION_MEMORY_UPPER.10
INSTRUCTION_A2: INSTRUC_REGISTER_LOWER.5(Q3) INSTRUCTION_MEMORY_LOWER.9 INSTRUCTION_MEMORY_UPPER2.9 INSTRUCTION_MEMORY_UPPER.9
INSTRUCTION_A3: INSTRUC_REGISTER_LOWER.4(Q2) INSTRUCTION_MEMORY_LOWER.8 INSTRUCTION_MEMORY_UPPER2.8 INSTRUCTION_MEMORY_UPPER.8
INSTRUCTION_A4: INSTRUC_REGISTER_LOWER.3(Q1) INSTRUCTION_MEMORY_LOWER.7 INSTRUCTION_MEMORY_UPPER2.7 INSTRUCTION_MEMORY_UPPER.7
INSTRUCTION_A5: INSTRUC_REGISTER_UPPER.5(Q3) INSTRUCTION_MEMORY_LOWER.5 INSTRUCTION_MEMORY_UPPER2.5 INSTRUCTION_MEMORY_UPPER.5
INSTRUCTION_A6: INSTRUC_REGISTER_UPPER.4(Q2) INSTRUCTION_MEMORY_LOWER.4 INSTRUCTION_MEMORY_UPPER2.4 INSTRUCTION_MEMORY_UPPER.4
INSTRUCTION_A7: INSTRUC_REGISTER_UPPER.3(Q1) INSTRUCTION_MEMORY_LOWER.3 INSTRUCTION_MEMORY_UPPER2.3 INSTRUCTION_MEMORY_UPPER.3
INSTRUCTION_REG_IN: INSTRUC_REGISTER_LOWER.9(G1) INSTRUC_REGISTER_LOWER.10(G2) INSTRUC_REGISTER_UPPER.9(G1) INSTRUC_REGISTER_UPPER.10(G2) INSTRUCTION_MEMORY_UPPER.18 MICRO_COUNTER_LOWER.1 MICRO_COUNTER_UPPER.1 NOT_GATE3_.2(A:O)
INV_HLT_SIGNAL: AND_GATE_.9(C:I0) NOT_GATE1.2(A:O)
INVERTED_CLOCK: INSTRUC_REGISTER_LOWER.7(CLK) INSTRUC_REGISTER_UPPER.7(CLK) INVERTED_CLK_LED.A MICRO_COUNTER_LOWER.2 MICRO_COUNTER_UPPER.2 NOT_GATE1.10(E:O)
LOGIC_1: LOGIC_LED_1.A LOGIC_SELECTOR-AND/OR_LOWER.4(1Y) LOGIC_SELECTOR-XOR/NOT_LOWER.4(1Y) OUTPUT_BUFFER_LOGIC.2(A1)
LOGIC_2: LOGIC_LED_2.A LOGIC_SELECTOR-AND/OR_LOWER.7(2Y) LOGIC_SELECTOR-XOR/NOT_LOWER.7(2Y) OUTPUT_BUFFER_LOGIC.3(A2)
LOGIC_3: LOGIC_LED_3.A LOGIC_SELECTOR-AND/OR_LOWER.9(3Y) LOGIC_SELECTOR-XOR/NOT_LOWER.9(3Y) OUTPUT_BUFFER_LOGIC.4(A3)
LOGIC_4: LOGIC_LED_4.A LOGIC_SELECTOR-AND/OR_LOWER.12(4Y) LOGIC_SELECTOR-XOR/NOT_LOWER.12(4Y) OUTPUT_BUFFER_LOGIC.5(A4)
LOGIC_5: LOGIC_LED_5.A LOGIC_SELECTOR-AND/OR_UPPER.4(1Y) LOGIC_SELECTOR-XOR/NOT_UPPER.4(1Y) OUTPUT_BUFFER_LOGIC.6(A5)
LOGIC_6: LOGIC_LED_6.A LOGIC_SELECTOR-AND/OR_UPPER.7(2Y) LOGIC_SELECTOR-XOR/NOT_UPPER.7(2Y) OUTPUT_BUFFER_LOGIC.7(A6)
LOGIC_7: LOGIC_LED_7.A LOGIC_SELECTOR-AND/OR_UPPER.9(3Y) LOGIC_SELECTOR-XOR/NOT_UPPER.9(3Y) OUTPUT_BUFFER_LOGIC.8(A7)
LOGIC_8: LOGIC_LED_8.A LOGIC_SELECTOR-AND/OR_UPPER.12(4Y) LOGIC_SELECTOR-XOR/NOT_UPPER.12(4Y) OUTPUT_BUFFER_LOGIC.9(A8)
LOGIC_OUT: INSTRUCTION_MEMORY_UPPER2.15 NOT_GATE.13(F:I)
LOGIC_SELECT_1: INSTRUCTION_MEMORY_UPPER2.12 LOGIC_SELECTOR-AND/OR_LOWER.1(!A!/B) LOGIC_SELECTOR-AND/OR_UPPER.1(!A!/B) LOGIC_SELECTOR-XOR/NOT_LOWER.1(!A!/B) LOGIC_SELECTOR-XOR/NOT_UPPER.1(!A!/B) SELECTOR_.2(A:A)
LOGIC_SELECT_2: INSTRUCTION_MEMORY_UPPER2.13 SELECTOR_.3(A:B)
MEMORY_IN: INSTRUCTION_MEMORY_LOWER.11 NOT_GATE1.5(C:I)
MEMORY_OUT: INSTRUCTION_MEMORY_LOWER.12 NOT_GATE1.9(D:I)
MICRO_A8: INSTRUCTION_MEMORY_LOWER.25 INSTRUCTION_MEMORY_UPPER2.25 INSTRUCTION_MEMORY_UPPER.25 MICRO_COUNTER_LOWER.14 USTEP_1.A
MICRO_A9: INSTRUCTION_MEMORY_LOWER.24 INSTRUCTION_MEMORY_UPPER2.24 INSTRUCTION_MEMORY_UPPER.24 MICRO_COUNTER_LOWER.13 USTEP_2.A
MICRO_A10: INSTRUCTION_MEMORY_LOWER.21 INSTRUCTION_MEMORY_UPPER2.21 INSTRUCTION_MEMORY_UPPER.21 MICRO_COUNTER_LOWER.12 USTEP_4.A
MICRO_A11: INSTRUCTION_MEMORY_LOWER.23 INSTRUCTION_MEMORY_UPPER2.23 INSTRUCTION_MEMORY_UPPER.23 MICRO_COUNTER_LOWER.11 USTEP_3.A
MICRO_A12: INSTRUCTION_MEMORY_LOWER.2 INSTRUCTION_MEMORY_UPPER2.2 INSTRUCTION_MEMORY_UPPER.2 MICRO_COUNTER_UPPER.14 USTEP_5.A
MODE_SIGNAL: AND_GATE_.4(B:I0) CLK_MODE.2(S1) NOT_GATE1.3(B:I) R4.2
N$1: C2.+ R3.1 STEPPER_CLOCK.6(THR) STEPPER_CLOCK.7(DIS)
N$2: CLK_TRIGGER.2(S1) R2.2 STEPPER_CLOCK.2(TR)
N$3: CLOCK.K(C) R5.2
N$4: AND_GATE_.5(B:I1) STEPPER_CLOCK.3(Q)
N$5: AND_GATE2_.13(D:I1) SELECTOR_.5(A:Y1)
N$6: AND_GATE_.1(A:I0) AUTO_CLOCK.3(Q)
N$7: PARAM_LED_3.K(C) R69.1
N$8: NOT_GATE3_.4(B:O) OUTPUT_BUFFER_ALU.19(G)
N$9: AND_GATE_.2(A:I1) NOT_GATE1.4(B:O)
N$10: NOT_GATE2_.10(E:O) PROGRAM_COUNTER_LOWER.10
N$11: AND_GATE_.10(C:I1) OR_GATE1.3(A:O)
N$12: PARAM_LED_2.K(C) R70.1
N$13: AND_GATE_.3(A:O) OR_GATE1.1(A:I0)
N$14: AND_GATE_.6(B:O) OR_GATE1.2(A:I1)
N$15: PARAM_LED_1.K(C) R71.1
N$16: AUTO_CLOCK.2(TR) AUTO_CLOCK.6(THR) C1.+ R1.2 R7.2
N$17: PARAM_LED_5.K(C) R72.1
N$18: MICRO_COUNTER_UPPER.13 NOT_GATE3_.1(A:I)
N$19: ADDER_LOWER.6(B1) SUBTRACT_INVRTR_LOWER_.11(D:O)
N$20: ADDER_LOWER.2(B2) SUBTRACT_INVRTR_LOWER_.8(C:O)
N$21: ADDER_LOWER.15(B3) SUBTRACT_INVRTR_LOWER_.6(B:O)
N$22: ADDER_LOWER.11(B4) SUBTRACT_INVRTR_LOWER_.3(A:O)
N$23: ADDER_UPPER.6(B1) SUBTRACT_INVRTR_UPPER_.11(D:O)
N$24: ADDER_UPPER.2(B2) SUBTRACT_INVRTR_UPPER_.8(C:O)
N$25: ADDER_UPPER.15(B3) SUBTRACT_INVRTR_UPPER_.6(B:O)
N$26: NOT_GATE2_.2(A:O) OUTPUT_BUFFER_CALC_REG.19(G)
N$27: ADDER_UPPER.11(B4) SUBTRACT_INVRTR_UPPER_.3(A:O)
N$28: OUTPUT_BUFFER_RAM.3(A2) RAM.12(I/O2) RAM_LED_2.A
N$29: OUTPUT_BUFFER_RAM.4(A3) RAM.13(I/O3) RAM_LED_3.A
N$30: OUTPUT_BUFFER_RAM.5(A4) RAM.15(I/O4) RAM_LED_4.A
N$31: OUTPUT_BUFFER_RAM.6(A5) RAM.16(I/O5) RAM_LED_5.A
N$32: OUTPUT_BUFFER_RAM.7(A6) RAM.17(I/O6) RAM_LED_6.A
N$33: OUTPUT_BUFFER_RAM.8(A7) RAM.18(I/O7) RAM_LED_7.A
N$34: OUTPUT_BUFFER_RAM.9(A8) RAM.19(I/O8) RAM_LED_8.A
N$35: R33.1 RAM_LED_2.K(C)
N$36: ADDR_REG_A_LOWER.9(G1) ADDR_REG_A_LOWER.10(G2) ADDR_REG_A_UPPER.9(G1) ADDR_REG_A_UPPER.10(G2) NOT_GATE2_.8(D:O)
N$37: OUTPUT_BUFFER_RAM.2(A1) RAM.11(I/O1) RAM_LED_1.A
N$38: R34.1 RAM_LED_3.K(C)
N$39: R35.1 RAM_LED_4.K(C)
N$40: FLAG_REG_LOWER.9(G1) FLAG_REG_LOWER.10(G2) FLAG_REG_UPPER.9(G1) FLAG_REG_UPPER.10(G2) NOT_GATE1.12(F:O)
N$41: FLAG_REG_LOWER.3(Q1) OUTPUT_BUFFER_FLAGS.11(B8) XOR_GATE_.1(A:I0)
N$42: FLAG_REG_LOWER.4(Q2) OUTPUT_BUFFER_FLAGS.12(B7) XOR_GATE_.4(B:I0)
N$43: FLAG_REG_LOWER.5(Q3) OUTPUT_BUFFER_FLAGS.13(B6) XOR_GATE_.9(C:I0)
N$44: FLAG_REG_LOWER.6(Q4) OUTPUT_BUFFER_FLAGS.14(B5) XOR_GATE_.12(D:I0)
N$45: NOT_GATE2_.6(C:O) OUTPUT_BUFFER_REG_A.19(G)
N$46: R36.1 RAM_LED_5.K(C)
N$47: R37.1 RAM_LED_6.K(C)
N$48: FLAG_REG_UPPER.3(Q1) OUTPUT_BUFFER_FLAGS.15(B4) XOR_GATE2_.2(A:I1)
N$49: R38.1 RAM_LED_7.K(C)
N$50: R39.1 RAM_LED_8.K(C)
N$51: FREQUENCY.S R7.1
N$52: R32.1 RAM_LED_1.K(C)
N$53: ADDR_REG_CALC_LOWER.9(G1) ADDR_REG_CALC_LOWER.10(G2) ADDR_REG_CALC_UPPER.9(G1) ADDR_REG_CALC_UPPER.10(G2) NOT_GATE2_.4(B:O)
N$54: ADDITIONAL_CONTROL_LINES.1 INSTRUCTION_MEMORY_UPPER2.18
N$55: RAM.5(A5)
N$56: NOT_GATE2_.12(F:O) OUTPUT_BUFFER_RAM.1(DIR) RAM.27(!WE)
N$57: FLAG_8.A FLAG_REG_LOWER.14(D1) XOR_GATE_.3(A:O)
N$58: FLAG_7.A FLAG_REG_LOWER.13(D2) XOR_GATE_.6(B:O)
N$59: FLAG_6.A FLAG_REG_LOWER.12(D3) XOR_GATE_.8(C:O)
N$60: FLAG_5.A FLAG_REG_LOWER.11(D4) XOR_GATE_.11(D:O)
N$61: FLAG_4.A FLAG_REG_UPPER.14(D1) XOR_GATE2_.3(A:O)
N$62: FLAG_3.A FLAG_REG_UPPER.13(D2) XOR_GATE2_.6(B:O)
N$63: FLAG_2.A FLAG_REG_UPPER.12(D3) XOR_GATE2_.8(C:O)
N$64: FLAG_1.A FLAG_REG_UPPER.11(D4) XOR_GATE2_.11(D:O)
N$65: FLAG_2.K(C) R14.2
N$66: FLAG_3.K(C) R13.2
N$67: FLAG_4.K(C) R12.2
N$68: FLAG_5.K(C) R11.2
N$69: FLAG_6.K(C) R10.2
N$70: FLAG_7.K(C) R9.2
N$71: FLAG_8.K(C) R8.2
N$72: FLAG_1.K(C) R15.1
N$74: RAM.6(A4)
N$75: RAM.4(A6)
N$76: ADDITIONAL_CONTROL_LINES.2 INSTRUCTION_MEMORY_UPPER2.19
N$77: RAM.7(A3)
N$78: AUTO_CLOCK.7(DIS) FREQUENCY.E
N$79: RAM.9(A1)
N$80: AND_GATE2_.12(D:I0) SELECTOR_.4(A:Y0)
N$81: NOT_GATE.12(F:O) OUTPUT_BUFFER_LOGIC.19(G)
N$82: LOGIC_SELECTOR-XOR/NOT_UPPER.13(4B) SUBTRACT_INVRTR_LOWER_1.11(D:O)
N$83: NOT_GATE.10(E:O) OUTPUT_BUFFER_FLAGS.19(G)
N$84: AND_GATE3_.1(A:I0) SELECTOR_.6(A:Y2)
N$85: AND_GATE_.11(D:O) LOGIC_SELECTOR-AND/OR_LOWER.2(1A)
N$86: LOGIC_SELECTOR-AND/OR_LOWER.3(1B) OR_GATE1.6(B:O)
N$87: RAM.3(A7) RAM_ADDR_UPPER.6(Q4)
N$88: RAM.10(A0) RAM_ADDR_LOWER.3(Q1)
N$89: RAM_ADDR_LOWER.4(Q2)
N$90: RAM.8(A2) RAM_ADDR_LOWER.5(Q3)
N$91: RAM_ADDR_LOWER.6(Q4)
N$92: RAM_ADDR_UPPER.3(Q1)
N$93: RAM_ADDR_UPPER.4(Q2)
N$94: RAM_ADDR_UPPER.5(Q3)
N$95: AND_GATE1_.3(A:O) LOGIC_SELECTOR-AND/OR_LOWER.5(2A)
N$96: LOGIC_SELECTOR-AND/OR_LOWER.6(2B) OR_GATE1.8(C:O)
N$97: LOGIC_SELECTOR-AND/OR_LOWER.10(3B) OR_GATE1.11(D:O)
N$98: AND_GATE1_.6(B:O) LOGIC_SELECTOR-AND/OR_LOWER.11(3A)
N$99: AND_GATE1_.8(C:O) LOGIC_SELECTOR-AND/OR_LOWER.14(4A)
N$100: LOGIC_SELECTOR-AND/OR_LOWER.13(4B) OR_GATE.3(A:O)
N$101: AND_GATE1_.11(D:O) LOGIC_SELECTOR-AND/OR_UPPER.2(1A)
N$102: LOGIC_SELECTOR-AND/OR_UPPER.3(1B) OR_GATE.6(B:O)
N$103: AND_GATE2_.3(A:O) LOGIC_SELECTOR-AND/OR_UPPER.5(2A)
N$104: LOGIC_SELECTOR-AND/OR_UPPER.6(2B) OR_GATE.8(C:O)
N$105: AND_GATE2_.6(B:O) LOGIC_SELECTOR-AND/OR_UPPER.11(3A)
N$106: LOGIC_SELECTOR-AND/OR_UPPER.10(3B) OR_GATE.11(D:O)
N$107: MICRO_COUNTER_LOWER.15 MICRO_COUNTER_UPPER.10
N$108: AND_GATE2_.8(C:O) LOGIC_SELECTOR-AND/OR_UPPER.14(4A)
N$109: LOGIC_SELECTOR-AND/OR_UPPER.13(4B) OR_GATE_2.3(A:O)
N$110: AND_GATE2_.11(D:O) LOGIC_SELECTOR-AND/OR_LOWER.15(G) LOGIC_SELECTOR-AND/OR_UPPER.15(G)
N$111: ADDR_REG_CALC_LOWER1.9(G1) ADDR_REG_CALC_LOWER1.10(G2) ADDR_REG_PARAM_UPPER.9(G1) ADDR_REG_PARAM_UPPER.10(G2) NOT_GATE2_1.4(B:O)
N$112: NOT_GATE2_1.2(A:O) OUTPUT_BUFFER_PARAM_REG.19(G)
N$113: INSTRUC_REGISTER_LOWER.15(CLR) INSTRUC_REGISTER_UPPER.15(CLR)
N$114: R40.2 USTEP_1.K(C)
N$115: R41.2 USTEP_2.K(C)
N$116: R42.2 USTEP_3.K(C)
N$117: R43.2 USTEP_4.K(C)
N$118: R44.2 USTEP_5.K(C)
N$119: LED_A_REG_1.K(C) R53.1
N$120: LED_A_REG_2.K(C) R54.1
N$121: LED_A_REG_3.K(C) R55.1
N$122: LED_A_REG_4.K(C) R56.1
N$123: LED_A_REG_5.K(C) R57.1
N$124: LED_A_REG_6.K(C) R58.1
N$125: LOGIC_SELECTOR-XOR/NOT_UPPER.14(4A) NOT_GATE.8(D:O)
N$126: LOGIC_SELECTOR-XOR/NOT_UPPER.10(3B) SUBTRACT_INVRTR_LOWER_1.8(C:O)
N$127: LOGIC_SELECTOR-XOR/NOT_UPPER.11(3A) NOT_GATE.6(C:O)
N$128: LOGIC_SELECTOR-XOR/NOT_UPPER.6(2B) SUBTRACT_INVRTR_LOWER_1.6(B:O)
N$129: LOGIC_SELECTOR-XOR/NOT_UPPER.5(2A) NOT_GATE.4(B:O)
N$130: LOGIC_SELECTOR-XOR/NOT_UPPER.3(1B) SUBTRACT_INVRTR_LOWER_1.3(A:O)
N$131: DATABUS_1.K(C) R24.1
N$132: INVERTED_CLK_LED.K(C) R45.2
N$133: DATABUS_2.K(C) R25.1
N$134: DATABUS_3.K(C) R26.1
N$135: DATABUS_4.K(C) R27.1
N$136: DATABUS_5.K(C) R28.1
N$137: DATABUS_6.K(C) R29.1
N$138: DATABUS_7.K(C) R30.1
N$139: ADDR_MEM_REG_LOWER.9(G1) ADDR_MEM_REG_LOWER.10(G2) ADDR_MEM_REG_UPPER.9(G1) ADDR_MEM_REG_UPPER.10(G2) NOT_GATE1.6(C:O)
N$140: DATABUS_8.K(C) R31.1
N$141: LOGIC_SELECTOR-XOR/NOT_UPPER.2(1A) NOT_GATE.2(A:O)
N$142: LOGIC_SELECTOR-XOR/NOT_LOWER.13(4B) SUBTRACT_INVRTR_UPPER_1.11(D:O)
N$143: LOGIC_SELECTOR-XOR/NOT_LOWER.10(3B) SUBTRACT_INVRTR_UPPER_1.8(C:O)
N$144: LOGIC_SELECTOR-XOR/NOT_LOWER.6(2B) SUBTRACT_INVRTR_UPPER_1.6(B:O)
N$145: LOGIC_SELECTOR-XOR/NOT_LOWER.3(1B) SUBTRACT_INVRTR_UPPER_1.3(A:O)
N$146: LOGIC_SELECTOR-XOR/NOT_LOWER.14(4A) NOT_GATE3_.12(F:O)
N$147: LOGIC_SELECTOR-XOR/NOT_LOWER.11(3A) NOT_GATE3_.10(E:O)
N$148: LOGIC_SELECTOR-XOR/NOT_LOWER.5(2A) NOT_GATE3_.8(D:O)
N$149: ADDR_MEM_REG_LOWER.6(Q4) MEMORY.10
N$150: ADDR_MEM_REG_LOWER.5(Q3) MEMORY.9
N$151: ADDR_MEM_REG_LOWER.4(Q2) MEMORY.8
N$152: ADDR_MEM_REG_LOWER.3(Q1) MEMORY.7
N$153: ADDR_MEM_REG_UPPER.6(Q4) MEMORY.6
N$154: ADDR_MEM_REG_UPPER.5(Q3) MEMORY.5
N$155: ADDR_MEM_REG_UPPER.4(Q2) MEMORY.4
N$156: ADDR_MEM_REG_UPPER.3(Q1) MEMORY.3
N$157: MEMORY.13 OUTPUT_BUFFER_MEMORY.7(A6)
N$158: MEMORY.12 OUTPUT_BUFFER_MEMORY.8(A7)
N$159: MEMORY.11 OUTPUT_BUFFER_MEMORY.9(A8)
N$160: MEMORY.15 OUTPUT_BUFFER_MEMORY.6(A5)
N$161: MEMORY.16 OUTPUT_BUFFER_MEMORY.5(A4)
N$162: MEMORY.17 OUTPUT_BUFFER_MEMORY.4(A3)
N$163: MEMORY.18 OUTPUT_BUFFER_MEMORY.3(A2)
N$164: MEMORY.19 OUTPUT_BUFFER_MEMORY.2(A1)
N$165: LOGIC_SELECTOR-XOR/NOT_LOWER.2(1A) NOT_GATE3_.6(C:O)
N$166: NOT_GATE1.8(D:O) OUTPUT_BUFFER_MEMORY.19(G)
N$167: AND_GATE3_.3(A:O) LOGIC_SELECTOR-XOR/NOT_LOWER.15(G) LOGIC_SELECTOR-XOR/NOT_UPPER.15(G)
N$168: AND_GATE3_.2(A:I1) SELECTOR_.7(A:Y3)
N$169: LED_A_REG_7.K(C) R59.1
N$170: PROGRAM_COUNTER_LOWER.15 PROGRAM_COUNTER_UPPER.10
N$171: OUTPUT_BUFFER_PC.9(A8) PC_1.A PROGRAM_COUNTER_LOWER.14
N$172: OUTPUT_BUFFER_PC.8(A7) PC_2.A PROGRAM_COUNTER_LOWER.13
N$173: OUTPUT_BUFFER_PC.7(A6) PC_3.A PROGRAM_COUNTER_LOWER.12
N$174: OUTPUT_BUFFER_PC.6(A5) PC_4.A PROGRAM_COUNTER_LOWER.11
N$175: OUTPUT_BUFFER_PC.4(A3) PC_6.A PROGRAM_COUNTER_UPPER.13
N$176: LED_A_REG_8.K(C) R60.1
N$177: PC_1.K(C) R16.1
N$178: PC_2.K(C) R17.1
N$179: PC_3.K(C) R18.1
N$180: PC_4.K(C) R19.1
N$181: PC_5.K(C) R20.1
N$182: PC_6.K(C) R21.1
N$183: PC_7.K(C) R22.1
N$184: PC_8.K(C) R23.1
N$185: LED_B_REG_1.K(C) R61.1
N$186: LED_B_REG_2.K(C) R62.1
N$187: LED_B_REG_3.K(C) R63.1
N$188: LED_B_REG_4.K(C) R64.1
N$189: LED_B_REG_5.K(C) R65.1
N$190: LOGIC_LED_7.K(C) R6.1
N$191: LED_B_REG_6.K(C) R66.1
N$192: LOGIC_LED_6.K(C) R46.1
N$193: LOGIC_LED_5.K(C) R47.1
N$194: OUTPUT_BUFFER_PC.3(A2) PC_7.A PROGRAM_COUNTER_UPPER.12
N$195: OUTPUT_BUFFER_PC.5(A4) PC_5.A PROGRAM_COUNTER_UPPER.14
N$196: OUTPUT_BUFFER_PC.2(A1) PC_8.A PROGRAM_COUNTER_UPPER.11
N$197: LOGIC_LED_4.K(C) R48.1
N$198: LOGIC_LED_3.K(C) R49.1
N$199: LOGIC_LED_2.K(C) R50.1
N$200: LOGIC_LED_1.K(C) R51.1
N$201: LOGIC_LED_8.K(C) R52.1
N$202: LED_B_REG_7.K(C) R67.1
N$203: LED_B_REG_8.K(C) R68.1
N$204: PARAM_LED_6.K(C) R73.1
N$205: PARAM_LED_7.K(C) R74.1
N$206: PARAM_LED_8.K(C) R75.1
N$207: PARAM_LED_4.K(C) R76.1
N$208: R72.2 R73.2 R74.2 R75.2
OVERFLOW_FLAG: ADDER_UPPER.9(C4) FLAG_REG_UPPER.4(Q2) OUTPUT_BUFFER_FLAGS.16(B3) XOR_GATE2_.5(B:I1)
P_REG_IN: INSTRUCTION_MEMORY_UPPER2.16 NOT_GATE2_1.3(B:I)
P_REG_OUT: INSTRUCTION_MEMORY_UPPER2.17 NOT_GATE2_1.1(A:I)
PC_INC: NOT_GATE2_.11(E:I) SELECTOR_.9(B:Y3)
PC_LOAD: PROGRAM_COUNTER_LOWER.9 PROGRAM_COUNTER_UPPER.9 SELECTOR_.11(B:Y1)
PC_OUT: OUTPUT_BUFFER_PC.19(G) SELECTOR_.10(B:Y2)
RAM_ADDR_IN: INSTRUCTION_MEMORY_LOWER.19 RAM_ADDR_LOWER.9(G1) RAM_ADDR_LOWER.10(G2) RAM_ADDR_UPPER.9(G1) RAM_ADDR_UPPER.10(G2)
RAM_IO: INSTRUCTION_MEMORY_UPPER.17 OUTPUT_BUFFER_RAM.19(G)
RAM_WRITE: INSTRUCTION_MEMORY_LOWER.18 NOT_GATE2_.13(F:I) RAM.22(!OE)
REG_A_1PLACE: ADDER_LOWER.5(A1) ADDR_REG_A_LOWER.6(Q4) AND_GATE_.12(D:I0) LED_A_REG_1.A NOT_GATE3_.5(C:I) OR_GATE1.4(B:I0) OUTPUT_BUFFER_REG_A.9(A8) SUBTRACT_INVRTR_UPPER_1.2(A:I1)
REG_A_2PLACE: ADDER_LOWER.3(A2) ADDR_REG_A_LOWER.5(Q3) AND_GATE1_.1(A:I0) LED_A_REG_2.A NOT_GATE3_.9(D:I) OR_GATE1.10(C:I1) OUTPUT_BUFFER_REG_A.8(A7) SUBTRACT_INVRTR_UPPER_1.5(B:I1)
REG_A_4PLACE: ADDER_LOWER.14(A3) ADDR_REG_A_LOWER.4(Q2) AND_GATE1_.4(B:I0) LED_A_REG_3.A NOT_GATE3_.11(E:I) OR_GATE1.13(D:I1) OUTPUT_BUFFER_REG_A.7(A6) SUBTRACT_INVRTR_UPPER_1.10(C:I1)
REG_A_8PLACE: ADDER_LOWER.12(A4) ADDR_REG_A_LOWER.3(Q1) AND_GATE1_.9(C:I0) LED_A_REG_4.A NOT_GATE3_.13(F:I) OR_GATE.2(A:I1) OUTPUT_BUFFER_REG_A.6(A5) SUBTRACT_INVRTR_UPPER_1.13(D:I1)
REG_A_16PLACE: ADDER_UPPER.5(A1) ADDR_REG_A_UPPER.6(Q4) AND_GATE1_.12(D:I0) LED_A_REG_5.A NOT_GATE.1(A:I) OR_GATE.5(B:I1) OUTPUT_BUFFER_REG_A.5(A4) SUBTRACT_INVRTR_LOWER_1.2(A:I1)
REG_A_32PLACE: ADDER_UPPER.3(A2) ADDR_REG_A_UPPER.5(Q3) AND_GATE2_.1(A:I0) LED_A_REG_6.A NOT_GATE.3(B:I) OR_GATE.10(C:I1) OUTPUT_BUFFER_REG_A.4(A3) SUBTRACT_INVRTR_LOWER_1.5(B:I1)
REG_A_64PLACE: ADDER_UPPER.14(A3) ADDR_REG_A_UPPER.4(Q2) AND_GATE2_.5(B:I1) LED_A_REG_7.A NOT_GATE.5(C:I) OR_GATE.12(D:I0) OUTPUT_BUFFER_REG_A.3(A2) SUBTRACT_INVRTR_LOWER_1.10(C:I1)
REG_A_128PLACE: ADDER_UPPER.12(A4) ADDR_REG_A_UPPER.3(Q1) AND_GATE2_.9(C:I0) LED_A_REG_8.A NOT_GATE.9(D:I) OR_GATE_2.2(A:I1) OUTPUT_BUFFER_REG_A.2(A1) SUBTRACT_INVRTR_LOWER_1.13(D:I1)
REG_A_IN: INSTRUCTION_MEMORY_LOWER.13 NOT_GATE2_.9(D:I)
REG_A_OUT: INSTRUCTION_MEMORY_LOWER.15 NOT_GATE2_.5(C:I)
REG_B_1PLACE: ADDR_REG_CALC_LOWER.6(Q4) AND_GATE_.13(D:I1) LED_B_REG_1.A OR_GATE1.5(B:I1) OUTPUT_BUFFER_CALC_REG.9(A8) SUBTRACT_INVRTR_LOWER_.13(D:I1) SUBTRACT_INVRTR_UPPER_1.1(A:I0)
REG_B_2PLACE: ADDR_REG_CALC_LOWER.5(Q3) AND_GATE1_.2(A:I1) LED_B_REG_2.A OR_GATE1.9(C:I0) OUTPUT_BUFFER_CALC_REG.8(A7) SUBTRACT_INVRTR_LOWER_.10(C:I1) SUBTRACT_INVRTR_UPPER_1.4(B:I0)
REG_B_4PLACE: ADDR_REG_CALC_LOWER.4(Q2) AND_GATE1_.5(B:I1) LED_B_REG_3.A OR_GATE1.12(D:I0) OUTPUT_BUFFER_CALC_REG.7(A6) SUBTRACT_INVRTR_LOWER_.5(B:I1) SUBTRACT_INVRTR_UPPER_1.9(C:I0)
REG_B_8PLACE: ADDR_REG_CALC_LOWER.3(Q1) AND_GATE1_.10(C:I1) LED_B_REG_4.A OR_GATE.1(A:I0) OUTPUT_BUFFER_CALC_REG.6(A5) SUBTRACT_INVRTR_LOWER_.2(A:I1) SUBTRACT_INVRTR_UPPER_1.12(D:I0)
REG_B_16PLACE: ADDR_REG_CALC_UPPER.6(Q4) AND_GATE1_.13(D:I1) LED_B_REG_5.A OR_GATE.4(B:I0) OUTPUT_BUFFER_CALC_REG.5(A4) SUBTRACT_INVRTR_LOWER_1.1(A:I0) SUBTRACT_INVRTR_UPPER_.13(D:I1)
REG_B_32PLACE: ADDR_REG_CALC_UPPER.5(Q3) AND_GATE2_.2(A:I1) LED_B_REG_6.A OR_GATE.9(C:I0) OUTPUT_BUFFER_CALC_REG.4(A3) SUBTRACT_INVRTR_LOWER_1.4(B:I0) SUBTRACT_INVRTR_UPPER_.10(C:I1)
REG_B_64PLACE: ADDR_REG_CALC_UPPER.4(Q2) AND_GATE2_.4(B:I0) LED_B_REG_7.A OR_GATE.13(D:I1) OUTPUT_BUFFER_CALC_REG.3(A2) SUBTRACT_INVRTR_LOWER_1.9(C:I0) SUBTRACT_INVRTR_UPPER_.5(B:I1)
REG_B_128PLACE: ADDR_REG_CALC_UPPER.3(Q1) AND_GATE2_.10(C:I1) LED_B_REG_8.A OR_GATE_2.1(A:I0) OUTPUT_BUFFER_CALC_REG.2(A1) SUBTRACT_INVRTR_LOWER_1.12(D:I0) SUBTRACT_INVRTR_UPPER_.2(A:I1)
REG_P_1PLACE: ADDR_REG_CALC_LOWER1.6(Q4) OUTPUT_BUFFER_PARAM_REG.9(A8) PARAM_LED_1.A
REG_P_2PLACE: ADDR_REG_CALC_LOWER1.5(Q3) OUTPUT_BUFFER_PARAM_REG.8(A7) PARAM_LED_2.A
REG_P_4PLACE: ADDR_REG_CALC_LOWER1.4(Q2) OUTPUT_BUFFER_PARAM_REG.7(A6) PARAM_LED_3.A
REG_P_8PLACE: ADDR_REG_CALC_LOWER1.3(Q1) OUTPUT_BUFFER_PARAM_REG.6(A5) PARAM_LED_4.A
REG_P_16PLACE: ADDR_REG_PARAM_UPPER.6(Q4) OUTPUT_BUFFER_PARAM_REG.5(A4) PARAM_LED_5.A
REG_P_32PLACE: ADDR_REG_PARAM_UPPER.5(Q3) OUTPUT_BUFFER_PARAM_REG.4(A3) PARAM_LED_6.A
REG_P_64PLACE: ADDR_REG_PARAM_UPPER.4(Q2) OUTPUT_BUFFER_PARAM_REG.3(A2) PARAM_LED_7.A
REG_P_128PLACE: ADDR_REG_PARAM_UPPER.3(Q1) OUTPUT_BUFFER_PARAM_REG.2(A1) PARAM_LED_8.A
SUM_1: ADDER_LOWER.4(S1) AND_GATE1.1(I0) OUTPUT_BUFFER_ALU.18(B1)
SUM_2: ADDER_LOWER.1(S2) AND_GATE1.2(I1) OUTPUT_BUFFER_ALU.17(B2)
SUM_4: ADDER_LOWER.13(S3) AND_GATE1.3(I2) OUTPUT_BUFFER_ALU.16(B3)
SUM_8: ADDER_LOWER.10(S4) AND_GATE1.4(I3) OUTPUT_BUFFER_ALU.15(B4)
SUM_16: ADDER_UPPER.4(S1) AND_GATE1.5(I4) OUTPUT_BUFFER_ALU.14(B5)
SUM_32: ADDER_UPPER.1(S2) AND_GATE1.6(I5) OUTPUT_BUFFER_ALU.13(B6)
SUM_64: ADDER_UPPER.13(S3) AND_GATE1.11(I6) OUTPUT_BUFFER_ALU.12(B7)
SUM_128: ADDER_UPPER.10(S4) AND_GATE1.12(I7) OUTPUT_BUFFER_ALU.11(B8)
SUM_CARRY: ADDER_LOWER.9(C4) ADDER_UPPER.7(C0)
VCC: ADDR_REG_A_LOWER.15(CLR) ADDR_REG_A_UPPER.15(CLR) ADDR_REG_CALC_LOWER1.15(CLR) ADDR_REG_CALC_LOWER.15(CLR) ADDR_REG_CALC_UPPER.15(CLR) ADDR_REG_PARAM_UPPER.15(CLR) INSTRUCTION_MEMORY_LOWER.27 INSTRUCTION_MEMORY_LOWER.28 INSTRUCTION_MEMORY_UPPER2.28 INSTRUCTION_MEMORY_UPPER.27 INSTRUCTION_MEMORY_UPPER.28 MEMORY.27 MEMORY.28 MICRO_COUNTER_LOWER.10 MICRO_COUNTER_LOWER.16 MICRO_COUNTER_UPPER.16 OUTPUT_BUFFER_CALC_REG.1(DIR) OUTPUT_BUFFER_LOGIC.1(DIR) OUTPUT_BUFFER_MEMORY.1(DIR) OUTPUT_BUFFER_PARAM_REG.1(DIR) OUTPUT_BUFFER_PC.1(DIR) OUTPUT_BUFFER_REG_A.1(DIR) POWER.2 PROGRAM_COUNTER_LOWER.1 PROGRAM_COUNTER_LOWER.16 PROGRAM_COUNTER_UPPER.1 PROGRAM_COUNTER_UPPER.16
ZERO_FLAG: AND_GATE1.8(O) FLAG_REG_UPPER.5(Q3) OUTPUT_BUFFER_FLAGS.17(B2) XOR_GATE2_.10(C:I1)
~DATA/PARAM: FLAG_REG_UPPER.6(Q4) MEMORY.25 OUTPUT_BUFFER_FLAGS.18(B1) XOR_GATE2_.13(D:I1)
Unconnected: AND_GATE3_.4(B:I0) AND_GATE3_.5(B:I1) AND_GATE3_.6(B:O) AND_GATE3_.8(C:O) AND_GATE3_.9(C:I0) AND_GATE3_.10(C:I1) AND_GATE3_.11(D:O) AND_GATE3_.12(D:I0) AND_GATE3_.13(D:I1) AUTO_CLOCK.5(CV) CLK_MODE.1(S) CLK_MODE.4(P1) CLK_TRIGGER.1(S) CLK_TRIGGER.4(P1) FREQUENCY.A INSTRUCTION_MEMORY_LOWER.1 INSTRUCTION_MEMORY_LOWER.26 INSTRUCTION_MEMORY_UPPER2.1 INSTRUCTION_MEMORY_UPPER2.26 INSTRUCTION_MEMORY_UPPER2.27 INSTRUCTION_MEMORY_UPPER.1 INSTRUCTION_MEMORY_UPPER.26 MEMORY.1 MEMORY.26 MICRO_COUNTER_LOWER.3 MICRO_COUNTER_LOWER.4 MICRO_COUNTER_LOWER.5 MICRO_COUNTER_LOWER.6 MICRO_COUNTER_LOWER.7 MICRO_COUNTER_UPPER.3 MICRO_COUNTER_UPPER.4 MICRO_COUNTER_UPPER.5 MICRO_COUNTER_UPPER.6 MICRO_COUNTER_UPPER.7 MICRO_COUNTER_UPPER.11 MICRO_COUNTER_UPPER.12 MICRO_COUNTER_UPPER.15 NOT_GATE2_1.5(C:I) NOT_GATE2_1.6(C:O) NOT_GATE2_1.8(D:O) NOT_GATE2_1.9(D:I) NOT_GATE2_1.10(E:O) NOT_GATE2_1.11(E:I) NOT_GATE2_1.12(F:O) NOT_GATE2_1.13(F:I) OR_GATE_2.4(B:I0) OR_GATE_2.5(B:I1) OR_GATE_2.6(B:O) OR_GATE_2.8(C:O) OR_GATE_2.9(C:I0) OR_GATE_2.10(C:I1) OR_GATE_2.11(D:O) OR_GATE_2.12(D:I0) OR_GATE_2.13(D:I1) PROGRAM_COUNTER_LOWER.7 PROGRAM_COUNTER_UPPER.7 PROGRAM_COUNTER_UPPER.15 SELECTOR_.12(B:Y0) STEPPER_CLOCK.4(R) STEPPER_CLOCK.5(CV)

## Notes on the sheet
- 1  2  3 4  5  6  7 8
- Clock
- CLK
- Register A
- Calculation Register
- CALC_IN
- CALC_OUT
- SUM OUT | RAM_ADDR_IN
- SUBTRACT | RAM_WRITE
- PC_IN
- PC_OUT
- Flag IN
- Reg A OUT
- Reg A OUT
- Reg A IN
- Reg A IN
- Memory OUT
- Memory IN
- Memory OUT | Memory IN
- INSTRUCTION IN | ~Data/Param
- HLT
- RAM_IO
- ZF | CF
- Parameter Register

## Power pins joined to a net without a drawn wire
GND: ADDER_LOWER.8(GND) ADDER_UPPER.8(GND) ADDR_MEM_REG_LOWER.8(GND) ADDR_MEM_REG_UPPER.8(GND) ADDR_REG_A_LOWER.8(GND) ADDR_REG_A_UPPER.8(GND) ADDR_REG_CALC_LOWER1.8(GND) ADDR_REG_CALC_LOWER.8(GND) ADDR_REG_CALC_UPPER.8(GND) ADDR_REG_PARAM_UPPER.8(GND) AND_GATE1.7(GND) AND_GATE1_.7(P:GND) AND_GATE2_.7(P:GND) AND_GATE3_.7(P:GND) AND_GATE_.7(P:GND) FLAG_REG_LOWER.8(GND) FLAG_REG_UPPER.8(GND) INSTRUC_REGISTER_LOWER.8(GND) INSTRUC_REGISTER_UPPER.8(GND) LOGIC_SELECTOR-AND/OR_LOWER.8(GND) LOGIC_SELECTOR-AND/OR_UPPER.8(GND) LOGIC_SELECTOR-XOR/NOT_LOWER.8(GND) LOGIC_SELECTOR-XOR/NOT_UPPER.8(GND) NOT_GATE1.7(P:GND) NOT_GATE2_1.7(P:GND) NOT_GATE2_.7(P:GND) NOT_GATE3_.7(P:GND) NOT_GATE.7(P:GND) OR_GATE1.7(P:GND) OR_GATE.7(P:GND) OR_GATE_2.7(P:GND) OUTPUT_BUFFER_ALU.10(GND) OUTPUT_BUFFER_CALC_REG.10(GND) OUTPUT_BUFFER_FLAGS.10(GND) OUTPUT_BUFFER_LOGIC.10(GND) OUTPUT_BUFFER_MEMORY.10(GND) OUTPUT_BUFFER_PARAM_REG.10(GND) OUTPUT_BUFFER_PC.10(GND) OUTPUT_BUFFER_RAM.10(GND) OUTPUT_BUFFER_REG_A.10(GND) RAM.14(GND) RAM_ADDR_LOWER.8(GND) RAM_ADDR_UPPER.8(GND) SELECTOR_.8(P:GND) SUBTRACT_INVRTR_LOWER_1.7(P:GND) SUBTRACT_INVRTR_LOWER_.7(P:GND) SUBTRACT_INVRTR_UPPER_1.7(P:GND) SUBTRACT_INVRTR_UPPER_.7(P:GND) XOR_GATE2_.7(P:GND) XOR_GATE_.7(P:GND)
VCC: ADDER_LOWER.16(VCC) ADDER_UPPER.16(VCC) ADDR_MEM_REG_LOWER.16(VCC) ADDR_MEM_REG_UPPER.16(VCC) ADDR_REG_A_LOWER.16(VCC) ADDR_REG_A_UPPER.16(VCC) ADDR_REG_CALC_LOWER1.16(VCC) ADDR_REG_CALC_LOWER.16(VCC) ADDR_REG_CALC_UPPER.16(VCC) ADDR_REG_PARAM_UPPER.16(VCC) AND_GATE1.14(VCC) AND_GATE1_.14(P:VCC) AND_GATE2_.14(P:VCC) AND_GATE3_.14(P:VCC) AND_GATE_.14(P:VCC) FLAG_REG_LOWER.16(VCC) FLAG_REG_UPPER.16(VCC) INSTRUC_REGISTER_LOWER.16(VCC) INSTRUC_REGISTER_UPPER.16(VCC) LOGIC_SELECTOR-AND/OR_LOWER.16(VCC) LOGIC_SELECTOR-AND/OR_UPPER.16(VCC) LOGIC_SELECTOR-XOR/NOT_LOWER.16(VCC) LOGIC_SELECTOR-XOR/NOT_UPPER.16(VCC) NOT_GATE1.14(P:VCC) NOT_GATE2_1.14(P:VCC) NOT_GATE2_.14(P:VCC) NOT_GATE3_.14(P:VCC) NOT_GATE.14(P:VCC) OR_GATE1.14(P:VCC) OR_GATE.14(P:VCC) OR_GATE_2.14(P:VCC) OUTPUT_BUFFER_ALU.20(VCC) OUTPUT_BUFFER_CALC_REG.20(VCC) OUTPUT_BUFFER_FLAGS.20(VCC) OUTPUT_BUFFER_LOGIC.20(VCC) OUTPUT_BUFFER_MEMORY.20(VCC) OUTPUT_BUFFER_PARAM_REG.20(VCC) OUTPUT_BUFFER_PC.20(VCC) OUTPUT_BUFFER_RAM.20(VCC) OUTPUT_BUFFER_REG_A.20(VCC) RAM.28(VCC) RAM_ADDR_LOWER.16(VCC) RAM_ADDR_UPPER.16(VCC) SELECTOR_.16(P:VCC) SUBTRACT_INVRTR_LOWER_1.14(P:VCC) SUBTRACT_INVRTR_LOWER_.14(P:VCC) SUBTRACT_INVRTR_UPPER_1.14(P:VCC) SUBTRACT_INVRTR_UPPER_.14(P:VCC) XOR_GATE2_.14(P:VCC) XOR_GATE_.14(P:VCC)

## Library data of the parts
ADDER_LOWER ADDER_UPPER = 74xx-eu:74*283: 4-bit binary FULL ADDER, fast carry
ADDITIONAL_CONTROL_LINES POWER = con-samtec:SSW-102-02-G-S: THROUGH-HOLE .025" SQ POST SOCKET Source: Samtec SSW.pdf; MF: Samtec Inc.; MPN: SSW-102-02-G-S; OC_FARNELL: unknown; OC_NEWARK: 11P9351
ADDR_MEM_REG_LOWER ADDR_MEM_REG_UPPER ADDR_REG_A_LOWER ADDR_REG_A_UPPER ADDR_REG_CALC_LOWER ADDR_REG_CALC_LOWER1 ADDR_REG_CALC_UPPER ADDR_REG_PARAM_UPPER FLAG_REG_LOWER FLAG_REG_UPPER INSTRUC_REGISTER_LOWER INSTRUC_REGISTER_UPPER RAM_ADDR_LOWER RAM_ADDR_UPPER = 74xx-eu:74*173: 4-bit D type REGISTER, 3-state
AND_GATE1 = 74xx-eu:74*30: 8-input NAND gate
AND_GATE1_ AND_GATE2_ AND_GATE3_ AND_GATE_ = 74xx-eu:74*08: Quad 2-input AND gate
AUTO_CLOCK STEPPER_CLOCK = linear:*555: TIMER
C1 C2 = rcl:CPOL-EU: POLARIZED CAPACITOR, European symbol; SPICEPREFIX: C
CLK_EXTENSION = con-samtec:SSW-101-02-G-S: THROUGH-HOLE .025" SQ POST SOCKET Source: Samtec SSW.pdf; MF: Samtec Inc.; MPN: SSW-101-02-G-S; OC_FARNELL: unknown; OC_NEWARK: 11P9336
CLK_MODE CLK_TRIGGER = switch-omron:10-XX: OMRON SWITCH; MPN: B3F-1000; OC_FARNELL: 176432; OC_NEWARK: 36M3542
CLOCK DATABUS_1-DATABUS_8 FLAG_1-FLAG_8 INVERTED_CLK_LED LED_A_REG_1-LED_A_REG_8 LED_B_REG_1-LED_B_REG_8 LOGIC_LED_1-LOGIC_LED_8 PARAM_LED_1-PARAM_LED_8 PC_1-PC_8 RAM_LED_1-RAM_LED_8 USTEP_1-USTEP_5 = led:LED: LED OSRAM: - CHIPLED LG R971, LG N971, LY N971, LG Q971, LY Q971, LO R971, LY R971 LH N974, LH R974 LS Q976, LO Q976, LY Q976 LO Q996 - Hyper CHIPLED LW Q18S LB Q993, LB Q99A, LB R99A - SideLED LS A670, LO A670, LY A670, LG A670, LP A670 LB A673, LV A673, LT A673, LW A673 LH A674 LY A675 LS A676, LA A676, LO A676, LY A676, LW A676 LS A679, LY A679, LG A679 - Hyper Micro SIDELED® LS Y876, LA Y876, LO Y876, LY Y876 LT Y87S - SmartLED LW L88C, LW L88S LB L89C, LB L89S, LG L890 LS L89K, LO L89K, LY L89K LS L896, LA L896, LO L896, LY L896 - TOPLED LS T670, LO T670, LY T670, LG T670, LP T670 LSG T670, LSP T670, LSY T670, LOP T670, LYG T670 LG T671, LOG T671, LSG T671 LB T673, LV T673, LT T673, LW T673 LH T674 LS T676, LA T676, LO T676, LY T676, LB T676, LH T676, LSB T676, LW T676 LB T67C, LV T67C, LT T67C, LS T67K, LO T67K, LY T67K, LW E67C LS E67B, LA E67B, LO E67B, LY E67B, LB E67C, LV E67C, LT E67C LW T67C LS T679, LY T679, LG T679 LS T770, LO T770, LY T770, LG T770, LP T770 LB T773, LV T773, LT T773, LW T773 LH T774 LS E675, LA E675, LY E675, LS T675 LS T776, LA T776, LO T776, LY T776, LB T776 LHGB T686 LT T68C, LB T68C - Hyper Mini TOPLED® LB M676 - Mini TOPLED Santana® LG M470 LS M47K, LO M47K, LY M47K Source: http://www.osram.convergy.de LUXEON: - LUMILED® LXK2-PW12-R00, LXK2-PW12-S00, LXK2-PW14-U00, LXK2-PW14-V00 LXK2-PM12-R00, LXK2-PM12-S00, LXK2-PM14-U00 LXK2-PE12-Q00, LXK2-PE12-R00, LXK2-PE12-S00, LXK2-PE14-T00, LXK2-PE14-U00 LXK2-PB12-K00, LXK2-PB12-L00, LXK2-PB12-M00, LXK2-PB14-N00, LXK2-PB14-P00, LXK2-PB14-Q00 LXK2-PR12-L00, LXK2-PR12-M00, LXK2-PR14-Q00, LXK2-PR14-R00 LXK2-PD12-Q00, LXK2-PD12-R00, LXK2-PD12-S00 LXK2-PH12-R00, LXK2-PH12-S00 LXK2-PL12-P00, LXK2-PL12-Q00, LXK2-PL12-R00 Source: www.luxeon.com KINGBRIGHT: KA-3528ASYC Source: www.kingbright.com
DATA_BUS_EXTENSION = con-samtec:SSW-108-02-G-S: THROUGH-HOLE .025" SQ POST SOCKET Source: Samtec SSW.pdf; MF: Samtec Inc.; MPN: SSW-108-02-G-S; OC_FARNELL: unknown; OC_NEWARK: 11P9448
FREQUENCY = pot:TRIM_EU-: POTENTIOMETER
INSTRUCTION_MEMORY_LOWER INSTRUCTION_MEMORY_UPPER INSTRUCTION_MEMORY_UPPER2 MEMORY = ic-package:DIL28: Dual In Line
LOGIC_SELECTOR-AND/OR_LOWER LOGIC_SELECTOR-AND/OR_UPPER LOGIC_SELECTOR-XOR/NOT_LOWER LOGIC_SELECTOR-XOR/NOT_UPPER = 74xx-eu:74*157: Quadruple 2-line to 1-line data SELECTOR/MULTIPLEXER
MICRO_COUNTER_LOWER MICRO_COUNTER_UPPER PROGRAM_COUNTER_LOWER PROGRAM_COUNTER_UPPER = ic-package:DIL16: Dual In Line / Socket
NOT_GATE NOT_GATE1 NOT_GATE2_ NOT_GATE2_1 NOT_GATE3_ = 74xx-eu:74*04: Hex INVERTER
OR_GATE OR_GATE1 OR_GATE_2 = 74xx-eu:74*32: Quad 2-input OR gate
OUTPUT_BUFFER_ALU OUTPUT_BUFFER_CALC_REG OUTPUT_BUFFER_FLAGS OUTPUT_BUFFER_LOGIC OUTPUT_BUFFER_MEMORY OUTPUT_BUFFER_PARAM_REG OUTPUT_BUFFER_PC OUTPUT_BUFFER_RAM OUTPUT_BUFFER_REG_A = 74xx-eu:74*245: Octal BUS TRANSCEIVER, 3-state
R1-R76 = rcl:R-US_: RESISTOR, American symbol; SPICEPREFIX: R
RAM = memory-idt:71256P: MEMORY; OC_FARNELL: unknown; OC_NEWARK: unknown
SELECTOR_ = 74xx-eu:74*139: Dual 2-line to 4-line DECODER/DEMULTIPLEXER
SUBTRACT_INVRTR_LOWER_ SUBTRACT_INVRTR_LOWER_1 SUBTRACT_INVRTR_UPPER_ SUBTRACT_INVRTR_UPPER_1 XOR_GATE2_ XOR_GATE_ = 74xx-eu:74*86: Quad 2-input EXCLUSIVE-OR (XOR) gate